# Altium project SOM_MODULE_LN_144201.PrjPcb (part 1 of 4)
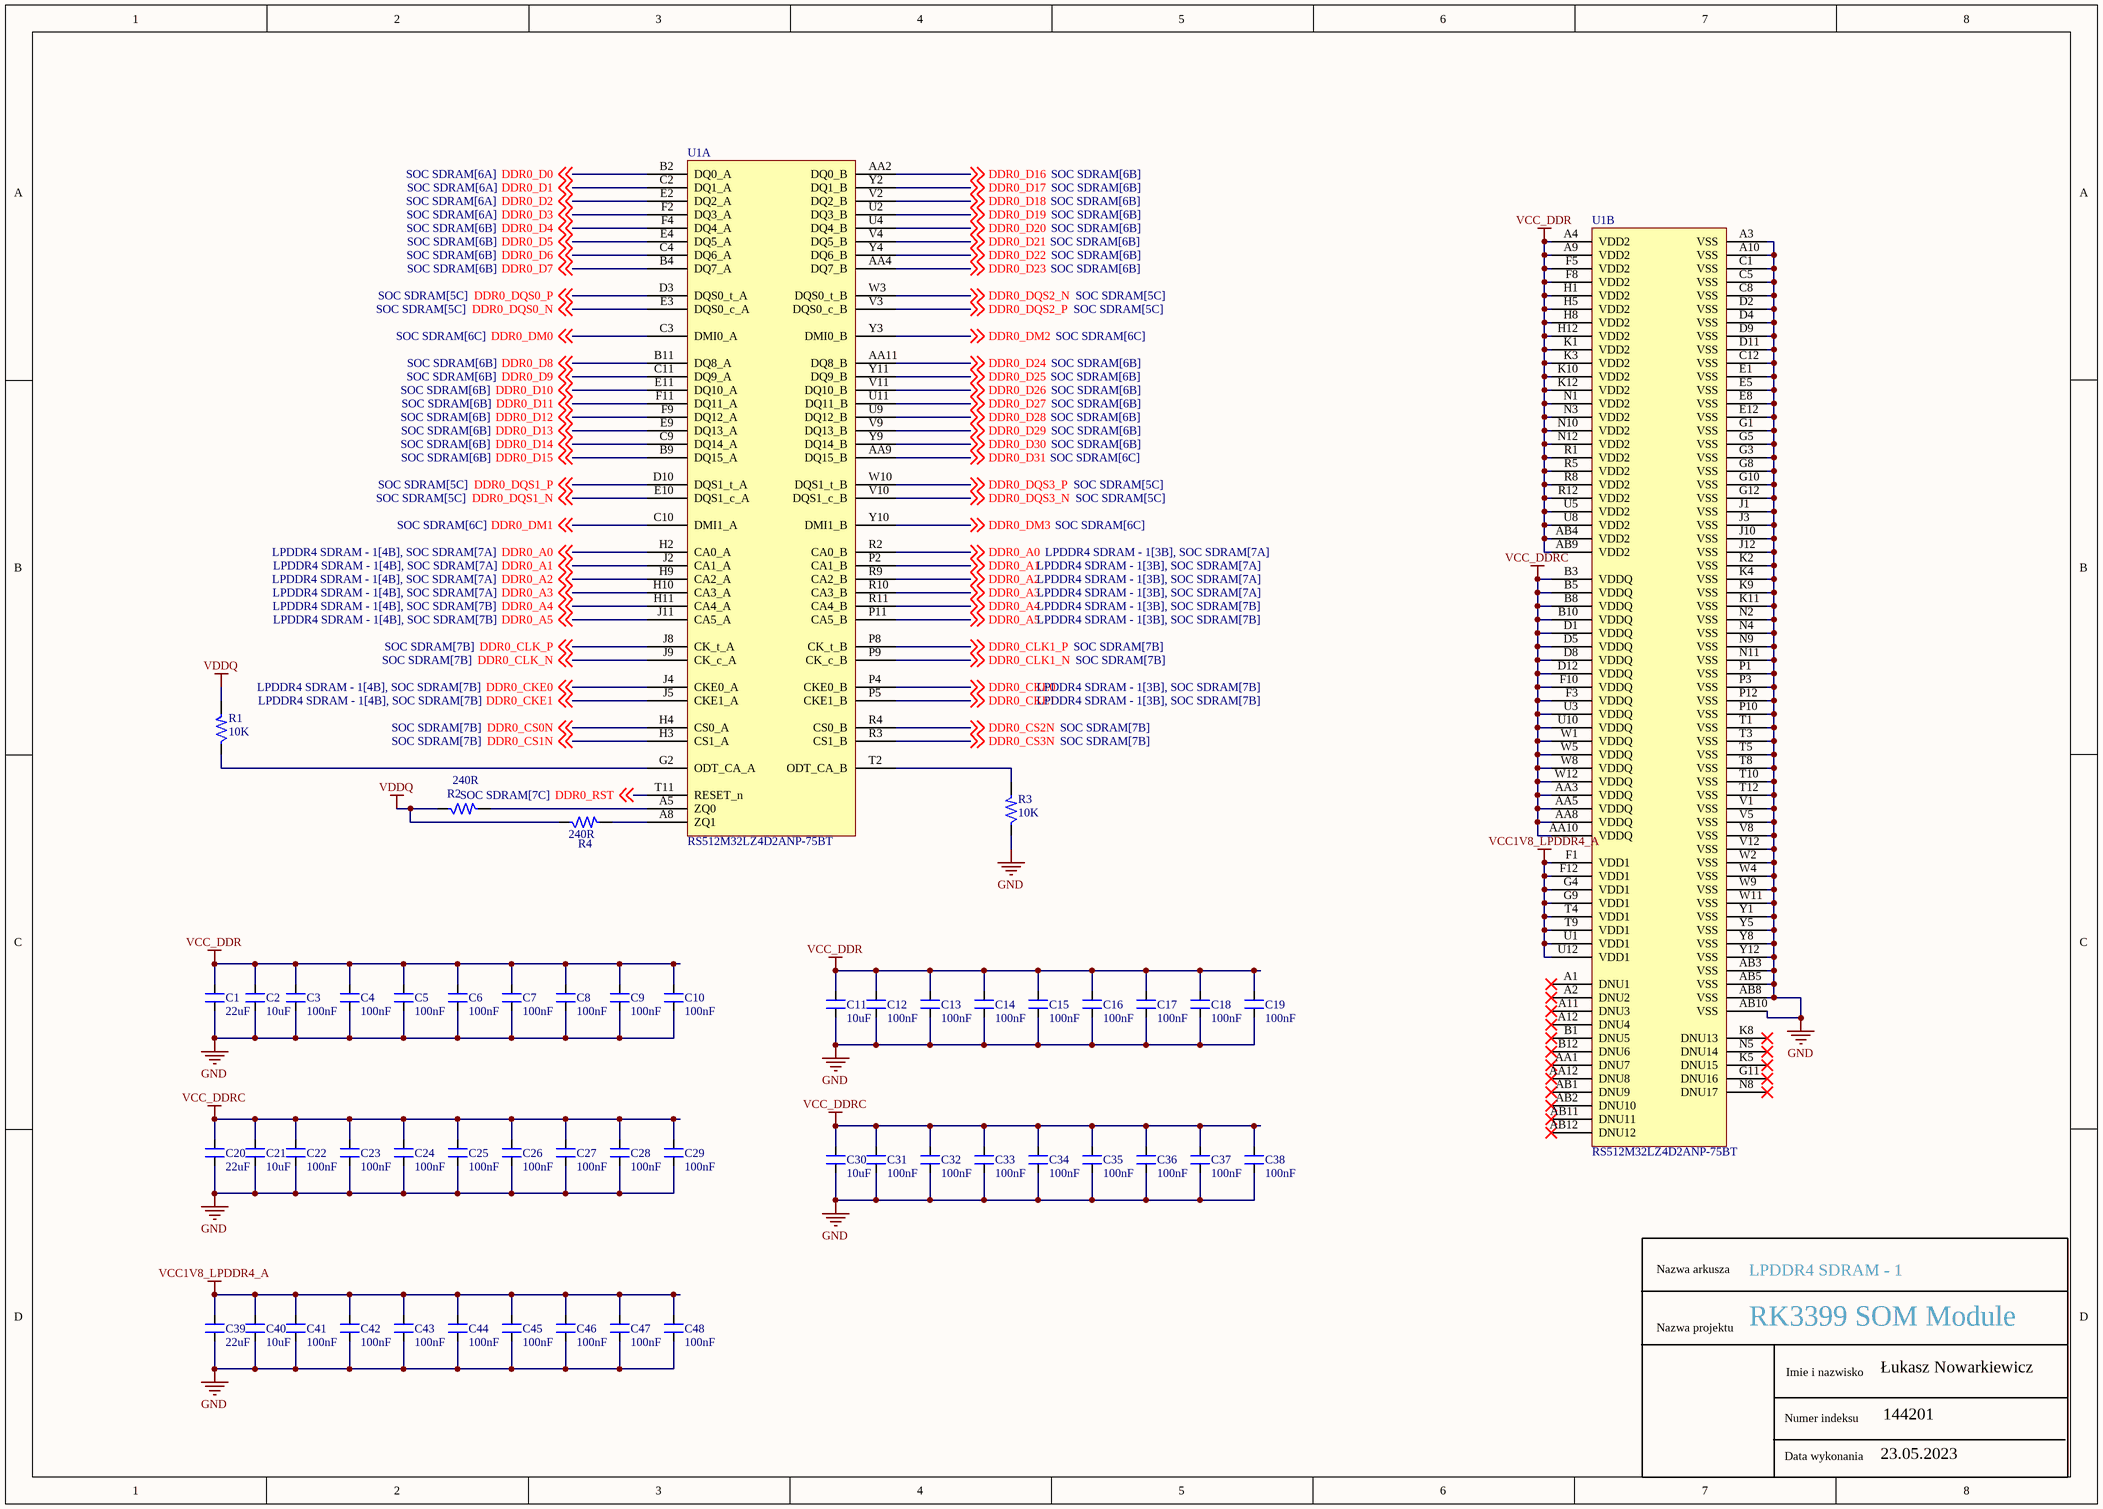
[diagram p0: LPDDR4 SDRAM - 1.SchDoc]
19 sheets, 574 parts. Net scope: global (net labels, ports and power ports of the same name join across sheets).
Board file: SOM.PcbDoc
Sheets:
  LPDDR4 SDRAM - 1.SchDoc
  LPDDR4 SDRAM - 2.SchDoc
  EMMC Flash memory.SchDoc
  WiFi module.SchDoc
  SOC SDRAM.SchDoc
  SOC Power Pins.SchDoc
  SOC EMMC, SDMMC, PCIE, ADC.SchDoc
  SOC Display, HDMI, EDP.SchDoc
  SOC USB, USIC.SchDoc
  SOC MIPI-CSI, I2C.SchDoc
  SOC PMU Controller.SchDoc
  SOC RGMII-SDIO, SPI.SchDoc
  USB C conn & ctrl.SchDoc
  ETH PHY IC.SchDoc
  BTNs and LEDs.SchDoc
  PWR ICs.SchDoc
  PMIC.SchDoc
  DDR4 Conn.SchDoc
  Miscellaneous.SchDoc

## Sheet LPDDR4 SDRAM - 1.SchDoc: RK3399 SOM Module
size A3; Date: 23.05.2023; Author: Łukasz Nowarkiewicz; SheetNumber: 1; SheetTotal: 21; RegistrationBookNumber: 144201; title_sheet: LPDDR4 SDRAM - 1

### Parts
C1  22uF  [CAP_0603]
C2  10uF  [CAP_0603]
C3  100nF  [CAP_0402]
C4  100nF  [CAP_0402]
C5  100nF  [CAP_0402]
C6  100nF  [CAP_0402]
C7  100nF  [CAP_0402]
C8  100nF  [CAP_0402]
C9  100nF  [CAP_0402]
C10  100nF  [CAP_0402]
C11  10uF  [CAP_0603]
C12  100nF  [CAP_0402]
C13  100nF  [CAP_0402]
C14  100nF  [CAP_0402]
C15  100nF  [CAP_0402]
C16  100nF  [CAP_0402]
C17  100nF  [CAP_0402]
C18  100nF  [CAP_0402]
C19  100nF  [CAP_0402]
C20  22uF  [CAP_0603]
C21  10uF  [CAP_0603]
C22  100nF  [CAP_0402]
C23  100nF  [CAP_0402]
C24  100nF  [CAP_0402]
C25  100nF  [CAP_0402]
C26  100nF  [CAP_0402]
C27  100nF  [CAP_0402]
C28  100nF  [CAP_0402]
C29  100nF  [CAP_0402]
C30  10uF  [CAP_0603]
C31  100nF  [CAP_0402]
C32  100nF  [CAP_0402]
C33  100nF  [CAP_0402]
C34  100nF  [CAP_0402]
C35  100nF  [CAP_0402]
C36  100nF  [CAP_0402]
C37  100nF  [CAP_0402]
C38  100nF  [CAP_0402]
C39  22uF  [CAP_0603]
C40  10uF  [CAP_0603]
C41  100nF  [CAP_0402]
C42  100nF  [CAP_0402]
C43  100nF  [CAP_0402]
C44  100nF  [CAP_0402]
C45  100nF  [CAP_0402]
C46  100nF  [CAP_0402]
C47  100nF  [CAP_0402]
C48  100nF  [CAP_0402]
R1  10K  [RES_0201]
R2  240R  [RES_0201]
R3  10K  [RES_0201]
R4  240R  [RES_0201]
U1  RS512M32LZ4D2ANP-75BT  [FBGA200_SMD]  (parts A,B of 2)

### Nets
GND: C1.1 C2.1 C3.1 C4.1 C5.1 C6.1 C7.1 C8.1 C9.1 C10.1 C11.1 C12.1 C13.1 C14.1 C15.1 C16.1 C17.1 C18.1 C19.1 C20.1 C21.1 C22.1 C23.1 C24.1 C25.1 C26.1 C27.1 C28.1 C29.1 C30.1 C31.1 C32.1 C33.1 C34.1 C35.1 C36.1 C37.1 C38.1 C39.1 C40.1 C41.1 C42.1 C43.1 C44.1 C45.1 C46.1 C47.1 C48.1 R3.1 U1.A3(VSS) U1.A10(VSS) U1.AB3(VSS) U1.AB5(VSS) U1.AB8(VSS) U1.AB10(VSS) U1.C1(VSS) U1.C5(VSS) U1.C8(VSS) U1.C12(VSS) U1.D2(VSS) U1.D4(VSS) U1.D9(VSS) U1.D11(VSS) U1.E1(VSS) U1.E5(VSS) U1.E8(VSS) U1.E12(VSS) U1.G1(VSS) U1.G3(VSS) U1.G5(VSS) U1.G8(VSS) U1.G10(VSS) U1.G12(VSS) U1.J1(VSS) U1.J3(VSS) U1.J10(VSS) U1.J12(VSS) U1.K2(VSS) U1.K4(VSS) U1.K9(VSS) U1.K11(VSS) U1.N2(VSS) U1.N4(VSS) U1.N9(VSS) U1.N11(VSS) U1.P1(VSS) U1.P3(VSS) U1.P10(VSS) U1.P12(VSS) U1.T1(VSS) U1.T3(VSS) U1.T5(VSS) U1.T8(VSS) U1.T10(VSS) U1.T12(VSS) U1.V1(VSS) U1.V5(VSS) U1.V8(VSS) U1.V12(VSS) U1.W2(VSS) U1.W4(VSS) U1.W9(VSS) U1.W11(VSS) U1.Y1(VSS) U1.Y5(VSS) U1.Y8(VSS) U1.Y12(VSS)
VCC1V8_LPDDR4_A: C39.2 C40.2 C41.2 C42.2 C43.2 C44.2 C45.2 C46.2 C47.2 C48.2 U1.F1(VDD1) U1.F12(VDD1) U1.G4(VDD1) U1.G9(VDD1) U1.T4(VDD1) U1.T9(VDD1) U1.U1(VDD1) U1.U12(VDD1)
VCC_DDR: C1.2 C2.2 C3.2 C4.2 C5.2 C6.2 C7.2 C8.2 C9.2 C10.2 C11.2 C12.2 C13.2 C14.2 C15.2 C16.2 C17.2 C18.2 C19.2 U1.A4(VDD2) U1.A9(VDD2) U1.AB4(VDD2) U1.AB9(VDD2) U1.F5(VDD2) U1.F8(VDD2) U1.H1(VDD2) U1.H5(VDD2) U1.H8(VDD2) U1.H12(VDD2) U1.K1(VDD2) U1.K3(VDD2) U1.K10(VDD2) U1.K12(VDD2) U1.N1(VDD2) U1.N3(VDD2) U1.N10(VDD2) U1.N12(VDD2) U1.R1(VDD2) U1.R5(VDD2) U1.R8(VDD2) U1.R12(VDD2) U1.U5(VDD2) U1.U8(VDD2)
VCC_DDRC: C20.2 C21.2 C22.2 C23.2 C24.2 C25.2 C26.2 C27.2 C28.2 C29.2 C30.2 C31.2 C32.2 C33.2 C34.2 C35.2 C36.2 C37.2 C38.2 U1.AA3(VDDQ) U1.AA5(VDDQ) U1.AA8(VDDQ) U1.AA10(VDDQ) U1.B3(VDDQ) U1.B5(VDDQ) U1.B8(VDDQ) U1.B10(VDDQ) U1.D1(VDDQ) U1.D5(VDDQ) U1.D8(VDDQ) U1.D12(VDDQ) U1.F3(VDDQ) U1.F10(VDDQ) U1.U3(VDDQ) U1.U10(VDDQ) U1.W1(VDDQ) U1.W5(VDDQ) U1.W8(VDDQ) U1.W12(VDDQ)
VDDQ: R1.2 R2.1 R4.1
DDR0_A0: U1.H2(CA0_A) U1.R2(CA0_B) ; off-sheet DDR0_A0
DDR0_A1: U1.J2(CA1_A) U1.P2(CA1_B) ; off-sheet DDR0_A1
DDR0_A2: U1.H9(CA2_A) U1.R9(CA2_B) ; off-sheet DDR0_A2
DDR0_A3: U1.H10(CA3_A) U1.R10(CA3_B) ; off-sheet DDR0_A3
DDR0_A4: U1.H11(CA4_A) U1.R11(CA4_B) ; off-sheet DDR0_A4
DDR0_A5: U1.J11(CA5_A) U1.P11(CA5_B) ; off-sheet DDR0_A5
DDR0_CKE0: U1.J4(CKE0_A) U1.P4(CKE0_B) ; off-sheet DDR0_CKE0
DDR0_CKE1: U1.J5(CKE1_A) U1.P5(CKE1_B) ; off-sheet DDR0_CKE1
DDR0_CLK1_N: U1.P9(CK_c_B) ; off-sheet DDR0_CLK1_N
DDR0_CLK1_P: U1.P8(CK_t_B) ; off-sheet DDR0_CLK1_P
DDR0_CLK_N: U1.J9(CK_c_A) ; off-sheet DDR0_CLK_N
DDR0_CLK_P: U1.J8(CK_t_A) ; off-sheet DDR0_CLK_P
DDR0_CS0N: U1.H4(CS0_A) ; off-sheet DDR0_CS0N
DDR0_CS1N: U1.H3(CS1_A) ; off-sheet DDR0_CS1N
DDR0_CS2N: U1.R4(CS0_B) ; off-sheet DDR0_CS2N
DDR0_CS3N: U1.R3(CS1_B) ; off-sheet DDR0_CS3N
DDR0_D0: U1.B2(DQ0_A) ; off-sheet DDR0_D0
DDR0_D1: U1.C2(DQ1_A) ; off-sheet DDR0_D1
DDR0_D2: U1.E2(DQ2_A) ; off-sheet DDR0_D2
DDR0_D3: U1.F2(DQ3_A) ; off-sheet DDR0_D3
DDR0_D4: U1.F4(DQ4_A) ; off-sheet DDR0_D4
DDR0_D5: U1.E4(DQ5_A) ; off-sheet DDR0_D5
DDR0_D6: U1.C4(DQ6_A) ; off-sheet DDR0_D6
DDR0_D7: U1.B4(DQ7_A) ; off-sheet DDR0_D7
DDR0_D8: U1.B11(DQ8_A) ; off-sheet DDR0_D8
DDR0_D9: U1.C11(DQ9_A) ; off-sheet DDR0_D9
DDR0_D10: U1.E11(DQ10_A) ; off-sheet DDR0_D10
DDR0_D11: U1.F11(DQ11_A) ; off-sheet DDR0_D11
DDR0_D12: U1.F9(DQ12_A) ; off-sheet DDR0_D12
DDR0_D13: U1.E9(DQ13_A) ; off-sheet DDR0_D13
DDR0_D14: U1.C9(DQ14_A) ; off-sheet DDR0_D14
DDR0_D15: U1.B9(DQ15_A) ; off-sheet DDR0_D15
DDR0_D16: U1.AA2(DQ0_B) ; off-sheet DDR0_D16
DDR0_D17: U1.Y2(DQ1_B) ; off-sheet DDR0_D17
DDR0_D18: U1.V2(DQ2_B) ; off-sheet DDR0_D18
DDR0_D19: U1.U2(DQ3_B) ; off-sheet DDR0_D19
DDR0_D20: U1.U4(DQ4_B) ; off-sheet DDR0_D20
DDR0_D21: U1.V4(DQ5_B) ; off-sheet DDR0_D21
DDR0_D22: U1.Y4(DQ6_B) ; off-sheet DDR0_D22
DDR0_D23: U1.AA4(DQ7_B) ; off-sheet DDR0_D23
DDR0_D24: U1.AA11(DQ8_B) ; off-sheet DDR0_D24
DDR0_D25: U1.Y11(DQ9_B) ; off-sheet DDR0_D25
DDR0_D26: U1.V11(DQ10_B) ; off-sheet DDR0_D26
DDR0_D27: U1.U11(DQ11_B) ; off-sheet DDR0_D27
DDR0_D28: U1.U9(DQ12_B) ; off-sheet DDR0_D28
DDR0_D29: U1.V9(DQ13_B) ; off-sheet DDR0_D29
DDR0_D30: U1.Y9(DQ14_B) ; off-sheet DDR0_D30
DDR0_D31: U1.AA9(DQ15_B) ; off-sheet DDR0_D31
DDR0_DM0: U1.C3(DMI0_A) ; off-sheet DDR0_DM0
DDR0_DM1: U1.C10(DMI1_A) ; off-sheet DDR0_DM1
DDR0_DM2: U1.Y3(DMI0_B) ; off-sheet DDR0_DM2
DDR0_DM3: U1.Y10(DMI1_B) ; off-sheet DDR0_DM3
DDR0_DQS0_N: U1.E3(DQS0_c_A) ; off-sheet DDR0_DQS0_N
DDR0_DQS0_P: U1.D3(DQS0_t_A) ; off-sheet DDR0_DQS0_P
DDR0_DQS1_N: U1.E10(DQS1_c_A) ; off-sheet DDR0_DQS1_N
DDR0_DQS1_P: U1.D10(DQS1_t_A) ; off-sheet DDR0_DQS1_P
DDR0_DQS2_N: U1.W3(DQS0_t_B) ; off-sheet DDR0_DQS2_N
DDR0_DQS2_P: U1.V3(DQS0_c_B) ; off-sheet DDR0_DQS2_P
DDR0_DQS3_N: U1.V10(DQS1_c_B) ; off-sheet DDR0_DQS3_N
DDR0_DQS3_P: U1.W10(DQS1_t_B) ; off-sheet DDR0_DQS3_P
DDR0_RST: U1.T11(RESET_n) ; off-sheet DDR0_RST
NetR1_1: R1.1 U1.G2(ODT_CA_A)
NetR2_2: R2.2 U1.A5(ZQ0)
NetR3_2: R3.2 U1.T2(ODT_CA_B)
NetR4_2: R4.2 U1.A8(ZQ1)

Not connected (* = marked no-connect by the designer): U1 A1(DNU1)* A2(DNU2)* A11(DNU3)* A12(DNU4)* AA1(DNU7)* AA12(DNU8)* AB1(DNU9)* AB2(DNU10)* AB11(DNU11)* AB12(DNU12)* B1(DNU5)* B12(DNU6)* G11(DNU16)* K5(DNU15)* K8(DNU13)* N5(DNU14)* N8(DNU17)*

### Notes on the sheet
- Nazwa arkusza
- Nazwa projektu
- Imie i nazwisko
- Data wykonania
- Numer indeksu

### Library data of the parts
C1 C20 C39 = CAP_22uF-10V-20%-0603: 22µF ±20% 10V Ceramic Capacitor X5R 0603 (1608 Metric); Manufacturer: Murata Electronics; Manufacturer Part Number: GRM188R61A226ME15D; Case/Package: 0603; Supplier-1: Digikey
C2 C11 C21 C30 C40 = CAP_10uF-10V-10%-0603: 10µF ±10% 10V Ceramic Capacitor X5R 0603 (1608 Metric); Manufacturer Part Number: GRM188R61A106KE69J; Manufacturer: Murata Electronics; Case/Package: 0603; Supplier-1: Digikey
C3-C10 C12-C19 C22-C29 C31-C38 C41-C48 = CAP_100nF-10V-10%-0402: 0.1µF ±10% 10V Ceramic Capacitor X7R 0402 (1005 Metric); Manufacturer: Yageo; Manufacturer Part Number: CC0402KRX7R6BB104; Case/Package: 0402; Supplier-1: Digikey
R1 R3 = RES_10K-0.05W-1%-0201: 10 kOhms ±1% 0.05W, 1/20W Chip Resistor 0201 (0603 Metric) Thick Film; Manufacturer: Stackpole Electronics Inc; Manufacturer Part Number: RMCF0201FT10K0; Case/Package: 0201; Supplier-1: Digikey
R2 R4 = RES_240R-0.05W-1%-0201: 240 Ohms ±1% 0.05W, 1/20W Chip Resistor 0201 (0603 Metric) Thick Film; Manufacturer: Yageo; Manufacturer Part Number: RC0201FR-07240RL; Case/Package: 0201; Supplier-1: Digikey
U1 = IC_RS512M32LZ4D2ANP-75BT: LPDDR4/4X Package FBGA 200b Density 4Gbit~64Gbit Operating Temperature Range：-25~85℃ Speed：2667Mbps/3200Mbps/3733Mbps Voltage：VDD1/VDD2/VDDQ= 1.8 / 1.1 / 1.1 V（LPDDR4）VDD1/VDD2/VDDQ = 1.8 / 1.1 / 0.6 V（LPDDR4X）Approved Verification Platform：MTK、Spreadtrum; Manufacturer: RAYSON; Manufacturer Part Number: RS512M32LZ4D2ANP-75BT; Case/Package: FBGA 200b; Supplier-1: RAYSON

## Sheet LPDDR4 SDRAM - 2.SchDoc: RK3399 SOM Module
size A3; Date: 23.05.2023; Author: Łukasz Nowarkiewicz; SheetNumber: 2; SheetTotal: 21; RegistrationBookNumber: 144201; title_sheet: LPDDR4 SDRAM - 2
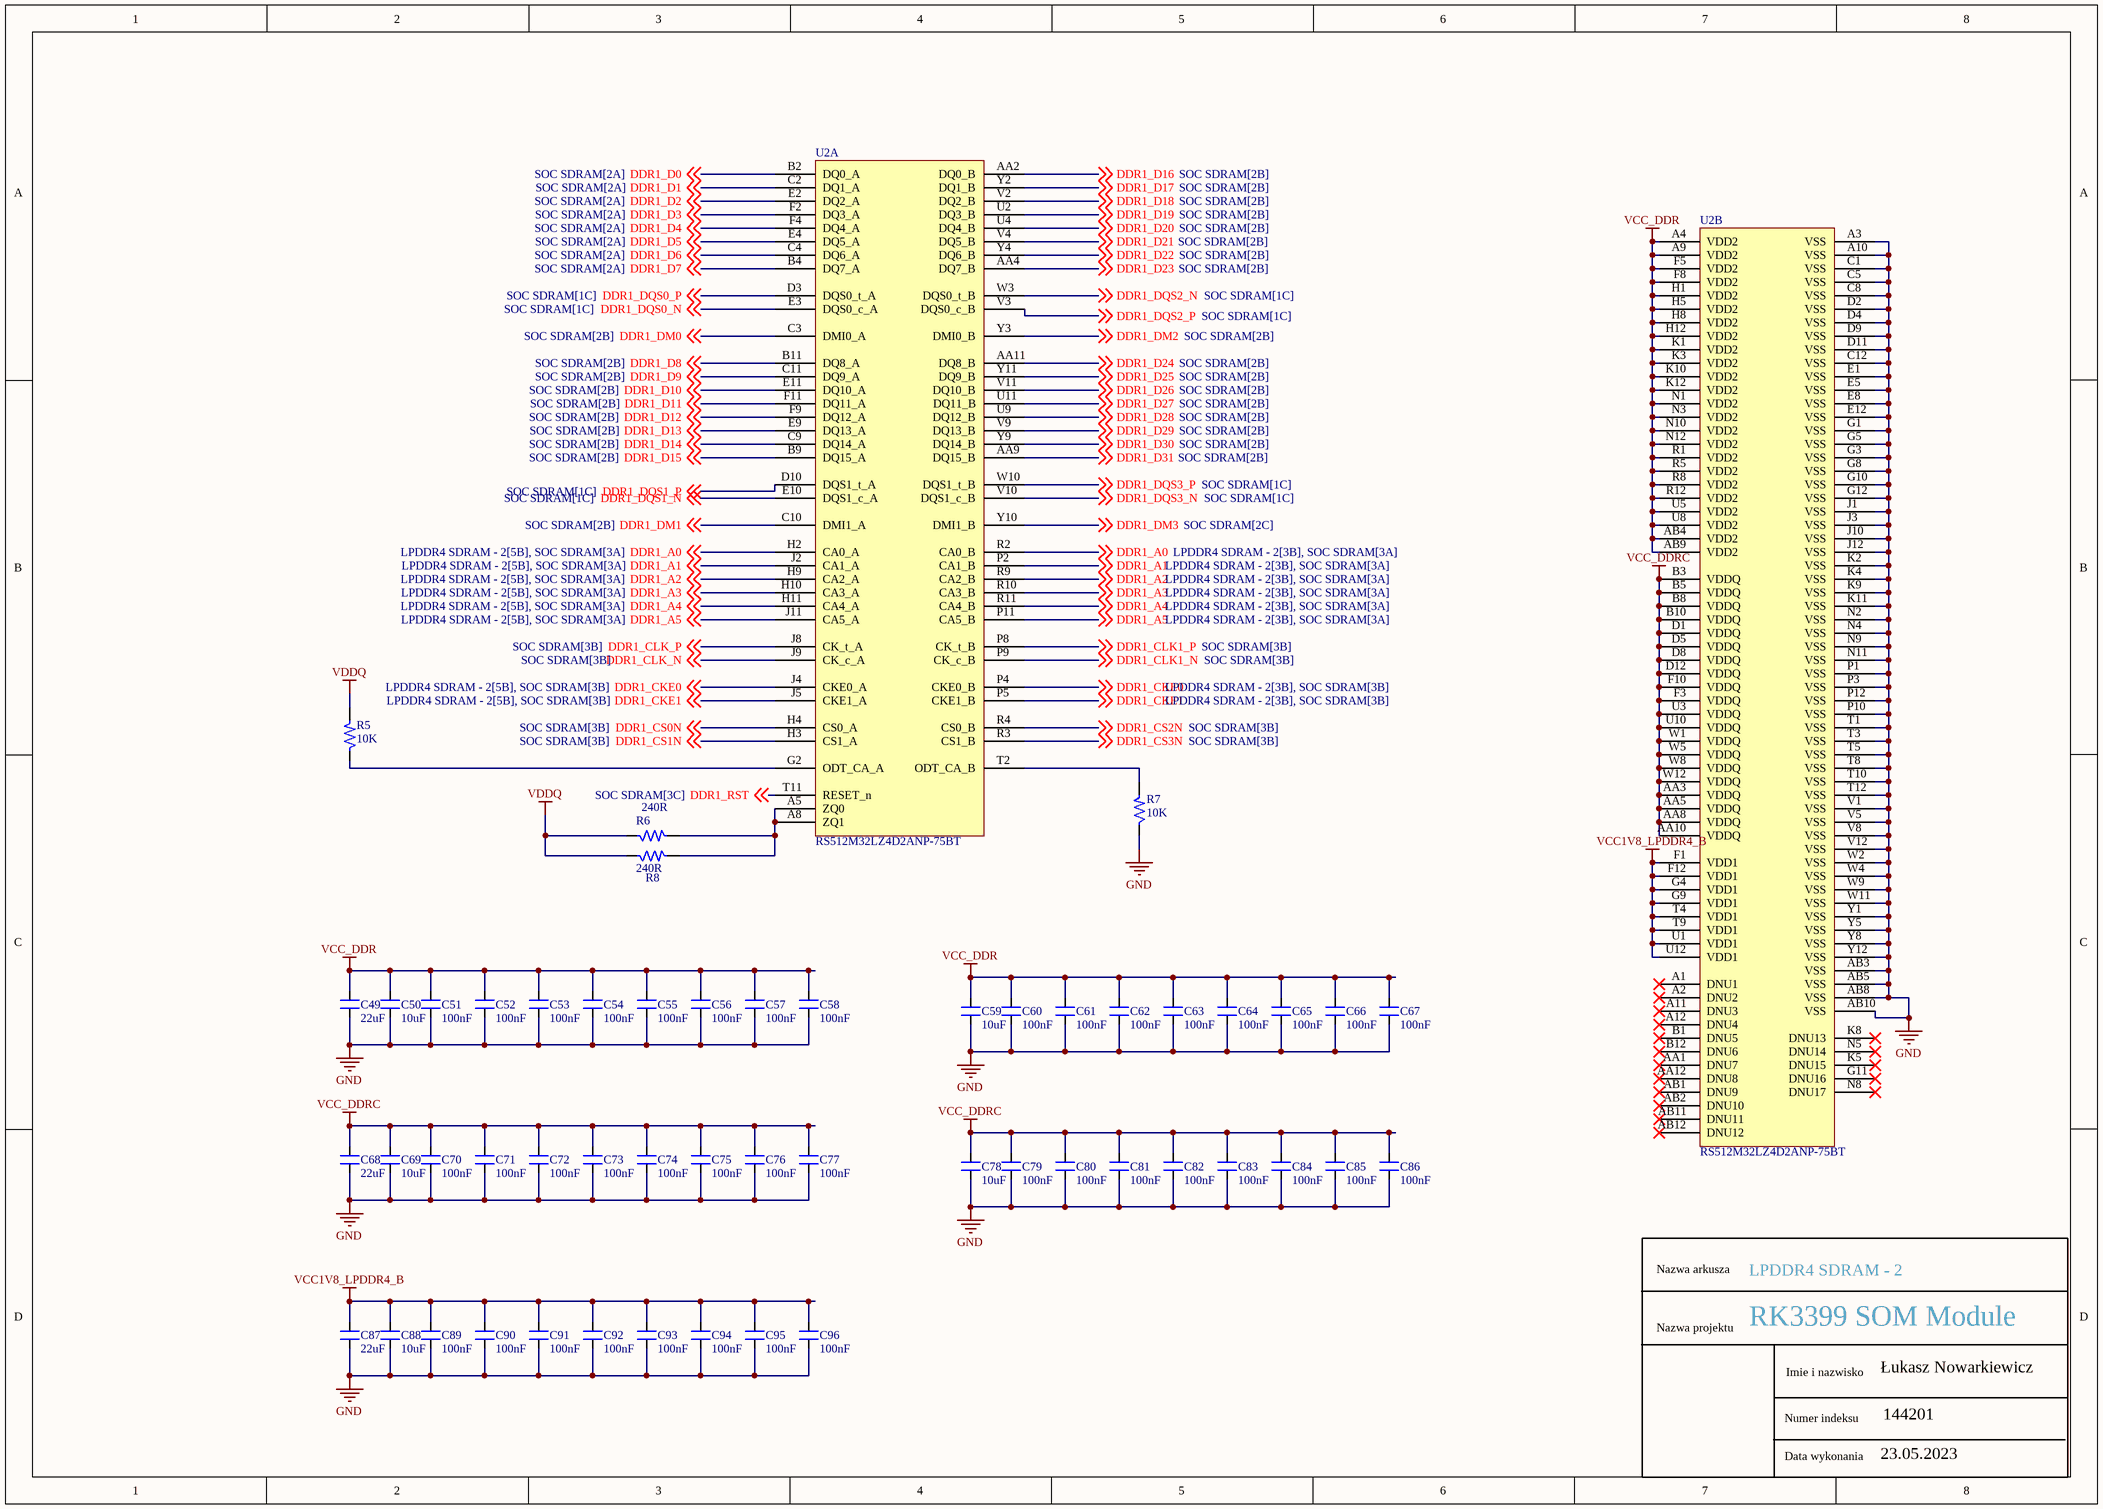
[diagram p1: LPDDR4 SDRAM - 2.SchDoc]

### Parts
C49  22uF  [CAP_0603]
C50  10uF  [CAP_0603]
C51  100nF  [CAP_0402]
C52  100nF  [CAP_0402]
C53  100nF  [CAP_0402]
C54  100nF  [CAP_0402]
C55  100nF  [CAP_0402]
C56  100nF  [CAP_0402]
C57  100nF  [CAP_0402]
C58  100nF  [CAP_0402]
C59  10uF  [CAP_0603]
C60  100nF  [CAP_0402]
C61  100nF  [CAP_0402]
C62  100nF  [CAP_0402]
C63  100nF  [CAP_0402]
C64  100nF  [CAP_0402]
C65  100nF  [CAP_0402]
C66  100nF  [CAP_0402]
C67  100nF  [CAP_0402]
C68  22uF  [CAP_0603]
C69  10uF  [CAP_0603]
C70  100nF  [CAP_0402]
C71  100nF  [CAP_0402]
C72  100nF  [CAP_0402]
C73  100nF  [CAP_0402]
C74  100nF  [CAP_0402]
C75  100nF  [CAP_0402]
C76  100nF  [CAP_0402]
C77  100nF  [CAP_0402]
C78  10uF  [CAP_0603]
C79  100nF  [CAP_0402]
C80  100nF  [CAP_0402]
C81  100nF  [CAP_0402]
C82  100nF  [CAP_0402]
C83  100nF  [CAP_0402]
C84  100nF  [CAP_0402]
C85  100nF  [CAP_0402]
C86  100nF  [CAP_0402]
C87  22uF  [CAP_0603]
C88  10uF  [CAP_0603]
C89  100nF  [CAP_0402]
C90  100nF  [CAP_0402]
C91  100nF  [CAP_0402]
C92  100nF  [CAP_0402]
C93  100nF  [CAP_0402]
C94  100nF  [CAP_0402]
C95  100nF  [CAP_0402]
C96  100nF  [CAP_0402]
R5  10K  [RES_0201]
R6  240R  [RES_0201]
R7  10K  [RES_0201]
R8  240R  [RES_0201]
U2  RS512M32LZ4D2ANP-75BT  [FBGA200_SMD]  (parts A,B of 2)

### Nets
GND: C49.1 C50.1 C51.1 C52.1 C53.1 C54.1 C55.1 C56.1 C57.1 C58.1 C59.1 C60.1 C61.1 C62.1 C63.1 C64.1 C65.1 C66.1 C67.1 C68.1 C69.1 C70.1 C71.1 C72.1 C73.1 C74.1 C75.1 C76.1 C77.1 C78.1 C79.1 C80.1 C81.1 C82.1 C83.1 C84.1 C85.1 C86.1 C87.1 C88.1 C89.1 C90.1 C91.1 C92.1 C93.1 C94.1 C95.1 C96.1 R7.1 U2.A3(VSS) U2.A10(VSS) U2.AB3(VSS) U2.AB5(VSS) U2.AB8(VSS) U2.AB10(VSS) U2.C1(VSS) U2.C5(VSS) U2.C8(VSS) U2.C12(VSS) U2.D2(VSS) U2.D4(VSS) U2.D9(VSS) U2.D11(VSS) U2.E1(VSS) U2.E5(VSS) U2.E8(VSS) U2.E12(VSS) U2.G1(VSS) U2.G3(VSS) U2.G5(VSS) U2.G8(VSS) U2.G10(VSS) U2.G12(VSS) U2.J1(VSS) U2.J3(VSS) U2.J10(VSS) U2.J12(VSS) U2.K2(VSS) U2.K4(VSS) U2.K9(VSS) U2.K11(VSS) U2.N2(VSS) U2.N4(VSS) U2.N9(VSS) U2.N11(VSS) U2.P1(VSS) U2.P3(VSS) U2.P10(VSS) U2.P12(VSS) U2.T1(VSS) U2.T3(VSS) U2.T5(VSS) U2.T8(VSS) U2.T10(VSS) U2.T12(VSS) U2.V1(VSS) U2.V5(VSS) U2.V8(VSS) U2.V12(VSS) U2.W2(VSS) U2.W4(VSS) U2.W9(VSS) U2.W11(VSS) U2.Y1(VSS) U2.Y5(VSS) U2.Y8(VSS) U2.Y12(VSS)
VCC1V8_LPDDR4_B: C87.2 C88.2 C89.2 C90.2 C91.2 C92.2 C93.2 C94.2 C95.2 C96.2 U2.F1(VDD1) U2.F12(VDD1) U2.G4(VDD1) U2.G9(VDD1) U2.T4(VDD1) U2.T9(VDD1) U2.U1(VDD1) U2.U12(VDD1)
VCC_DDR: C49.2 C50.2 C51.2 C52.2 C53.2 C54.2 C55.2 C56.2 C57.2 C58.2 C59.2 C60.2 C61.2 C62.2 C63.2 C64.2 C65.2 C66.2 C67.2 U2.A4(VDD2) U2.A9(VDD2) U2.AB4(VDD2) U2.AB9(VDD2) U2.F5(VDD2) U2.F8(VDD2) U2.H1(VDD2) U2.H5(VDD2) U2.H8(VDD2) U2.H12(VDD2) U2.K1(VDD2) U2.K3(VDD2) U2.K10(VDD2) U2.K12(VDD2) U2.N1(VDD2) U2.N3(VDD2) U2.N10(VDD2) U2.N12(VDD2) U2.R1(VDD2) U2.R5(VDD2) U2.R8(VDD2) U2.R12(VDD2) U2.U5(VDD2) U2.U8(VDD2)
VCC_DDRC: C68.2 C69.2 C70.2 C71.2 C72.2 C73.2 C74.2 C75.2 C76.2 C77.2 C78.2 C79.2 C80.2 C81.2 C82.2 C83.2 C84.2 C85.2 C86.2 U2.AA3(VDDQ) U2.AA5(VDDQ) U2.AA8(VDDQ) U2.AA10(VDDQ) U2.B3(VDDQ) U2.B5(VDDQ) U2.B8(VDDQ) U2.B10(VDDQ) U2.D1(VDDQ) U2.D5(VDDQ) U2.D8(VDDQ) U2.D12(VDDQ) U2.F3(VDDQ) U2.F10(VDDQ) U2.U3(VDDQ) U2.U10(VDDQ) U2.W1(VDDQ) U2.W5(VDDQ) U2.W8(VDDQ) U2.W12(VDDQ)
VDDQ: R5.2 R6.1 R8.1
DDR1_A0: U2.H2(CA0_A) U2.R2(CA0_B) ; off-sheet DDR1_A0
DDR1_A1: U2.J2(CA1_A) U2.P2(CA1_B) ; off-sheet DDR1_A1
DDR1_A2: U2.H9(CA2_A) U2.R9(CA2_B) ; off-sheet DDR1_A2
DDR1_A3: U2.H10(CA3_A) U2.R10(CA3_B) ; off-sheet DDR1_A3
DDR1_A4: U2.H11(CA4_A) U2.R11(CA4_B) ; off-sheet DDR1_A4
DDR1_A5: U2.J11(CA5_A) U2.P11(CA5_B) ; off-sheet DDR1_A5
DDR1_CKE0: U2.J4(CKE0_A) U2.P4(CKE0_B) ; off-sheet DDR1_CKE0
DDR1_CKE1: U2.J5(CKE1_A) U2.P5(CKE1_B) ; off-sheet DDR1_CKE1
DDR1_CLK1_N: U2.P9(CK_c_B) ; off-sheet DDR1_CLK1_N
DDR1_CLK1_P: U2.P8(CK_t_B) ; off-sheet DDR1_CLK1_P
DDR1_CLK_N: U2.J9(CK_c_A) ; off-sheet DDR1_CLK_N
DDR1_CLK_P: U2.J8(CK_t_A) ; off-sheet DDR1_CLK_P
DDR1_CS0N: U2.H4(CS0_A) ; off-sheet DDR1_CS0N
DDR1_CS1N: U2.H3(CS1_A) ; off-sheet DDR1_CS1N
DDR1_CS2N: U2.R4(CS0_B) ; off-sheet DDR1_CS2N
DDR1_CS3N: U2.R3(CS1_B) ; off-sheet DDR1_CS3N
DDR1_D0: U2.B2(DQ0_A) ; off-sheet DDR1_D0
DDR1_D1: U2.C2(DQ1_A) ; off-sheet DDR1_D1
DDR1_D2: U2.E2(DQ2_A) ; off-sheet DDR1_D2
DDR1_D3: U2.F2(DQ3_A) ; off-sheet DDR1_D3
DDR1_D4: U2.F4(DQ4_A) ; off-sheet DDR1_D4
DDR1_D5: U2.E4(DQ5_A) ; off-sheet DDR1_D5
DDR1_D6: U2.C4(DQ6_A) ; off-sheet DDR1_D6
DDR1_D7: U2.B4(DQ7_A) ; off-sheet DDR1_D7
DDR1_D8: U2.B11(DQ8_A) ; off-sheet DDR1_D8
DDR1_D9: U2.C11(DQ9_A) ; off-sheet DDR1_D9
DDR1_D10: U2.E11(DQ10_A) ; off-sheet DDR1_D10
DDR1_D11: U2.F11(DQ11_A) ; off-sheet DDR1_D11
DDR1_D12: U2.F9(DQ12_A) ; off-sheet DDR1_D12
DDR1_D13: U2.E9(DQ13_A) ; off-sheet DDR1_D13
DDR1_D14: U2.C9(DQ14_A) ; off-sheet DDR1_D14
DDR1_D15: U2.B9(DQ15_A) ; off-sheet DDR1_D15
DDR1_D16: U2.AA2(DQ0_B) ; off-sheet DDR1_D16
DDR1_D17: U2.Y2(DQ1_B) ; off-sheet DDR1_D17
DDR1_D18: U2.V2(DQ2_B) ; off-sheet DDR1_D18
DDR1_D19: U2.U2(DQ3_B) ; off-sheet DDR1_D19
DDR1_D20: U2.U4(DQ4_B) ; off-sheet DDR1_D20
DDR1_D21: U2.V4(DQ5_B) ; off-sheet DDR1_D21
DDR1_D22: U2.Y4(DQ6_B) ; off-sheet DDR1_D22
DDR1_D23: U2.AA4(DQ7_B) ; off-sheet DDR1_D23
DDR1_D24: U2.AA11(DQ8_B) ; off-sheet DDR1_D24
DDR1_D25: U2.Y11(DQ9_B) ; off-sheet DDR1_D25
DDR1_D26: U2.V11(DQ10_B) ; off-sheet DDR1_D26
DDR1_D27: U2.U11(DQ11_B) ; off-sheet DDR1_D27
DDR1_D28: U2.U9(DQ12_B) ; off-sheet DDR1_D28
DDR1_D29: U2.V9(DQ13_B) ; off-sheet DDR1_D29
DDR1_D30: U2.Y9(DQ14_B) ; off-sheet DDR1_D30
DDR1_D31: U2.AA9(DQ15_B) ; off-sheet DDR1_D31
DDR1_DM0: U2.C3(DMI0_A) ; off-sheet DDR1_DM0
DDR1_DM1: U2.C10(DMI1_A) ; off-sheet DDR1_DM1
DDR1_DM2: U2.Y3(DMI0_B) ; off-sheet DDR1_DM2
DDR1_DM3: U2.Y10(DMI1_B) ; off-sheet DDR1_DM3
DDR1_DQS0_N: U2.E3(DQS0_c_A) ; off-sheet DDR1_DQS0_N
DDR1_DQS0_P: U2.D3(DQS0_t_A) ; off-sheet DDR1_DQS0_P
DDR1_DQS1_N: U2.E10(DQS1_c_A) ; off-sheet DDR1_DQS1_N
DDR1_DQS1_P: U2.D10(DQS1_t_A) ; off-sheet DDR1_DQS1_P
DDR1_DQS2_N: U2.W3(DQS0_t_B) ; off-sheet DDR1_DQS2_N
DDR1_DQS2_P: U2.V3(DQS0_c_B) ; off-sheet DDR1_DQS2_P
DDR1_DQS3_N: U2.V10(DQS1_c_B) ; off-sheet DDR1_DQS3_N
DDR1_DQS3_P: U2.W10(DQS1_t_B) ; off-sheet DDR1_DQS3_P
DDR1_RST: U2.T11(RESET_n) ; off-sheet DDR1_RST
NetR5_1: R5.1 U2.G2(ODT_CA_A)
NetR6_2: R6.2 R8.2 U2.A5(ZQ0) U2.A8(ZQ1)
NetR7_2: R7.2 U2.T2(ODT_CA_B)

Not connected (* = marked no-connect by the designer): U2 A1(DNU1)* A2(DNU2)* A11(DNU3)* A12(DNU4)* AA1(DNU7)* AA12(DNU8)* AB1(DNU9)* AB2(DNU10)* AB11(DNU11)* AB12(DNU12)* B1(DNU5)* B12(DNU6)* G11(DNU16)* K5(DNU15)* K8(DNU13)* N5(DNU14)* N8(DNU17)*

### Notes on the sheet
- Nazwa arkusza
- Nazwa projektu
- Imie i nazwisko
- Data wykonania
- Numer indeksu

### Library data of the parts
C49 C68 C87 = CAP_22uF-10V-20%-0603: as C1 on sheet LPDDR4 SDRAM - 1; Case/Package: 0603; Supplier-1: Digikey
C50 C59 C69 C78 C88 = CAP_10uF-10V-10%-0603: as C2 on sheet LPDDR4 SDRAM - 1; Case/Package: 0603; Supplier-1: Digikey
C51-C58 C60-C67 C70-C77 C79-C86 C89-C96 = CAP_100nF-10V-10%-0402: as C3 on sheet LPDDR4 SDRAM - 1; Case/Package: 0402; Supplier-1: Digikey
R5 R7 = RES_10K-0.05W-1%-0201: as R1 on sheet LPDDR4 SDRAM - 1; Case/Package: 0201; Supplier-1: Digikey
R6 R8 = RES_240R-0.05W-1%-0201: as R2 on sheet LPDDR4 SDRAM - 1; Case/Package: 0201; Supplier-1: Digikey
U2 = IC_RS512M32LZ4D2ANP-75BT: as U1 on sheet LPDDR4 SDRAM - 1; Manufacturer Part Number: RS512M32LZ4D2ANP-75BT; Case/Package: FBGA 200b; Supplier-1: RAYSON

## Sheet EMMC Flash memory.SchDoc: RK3399 SOM Module
size A4; Date: 23.05.2023; Author: Łukasz Nowarkiewicz; SheetNumber: 3; SheetTotal: 21; RegistrationBookNumber: 144201; title_sheet: EMMC Flash Memory
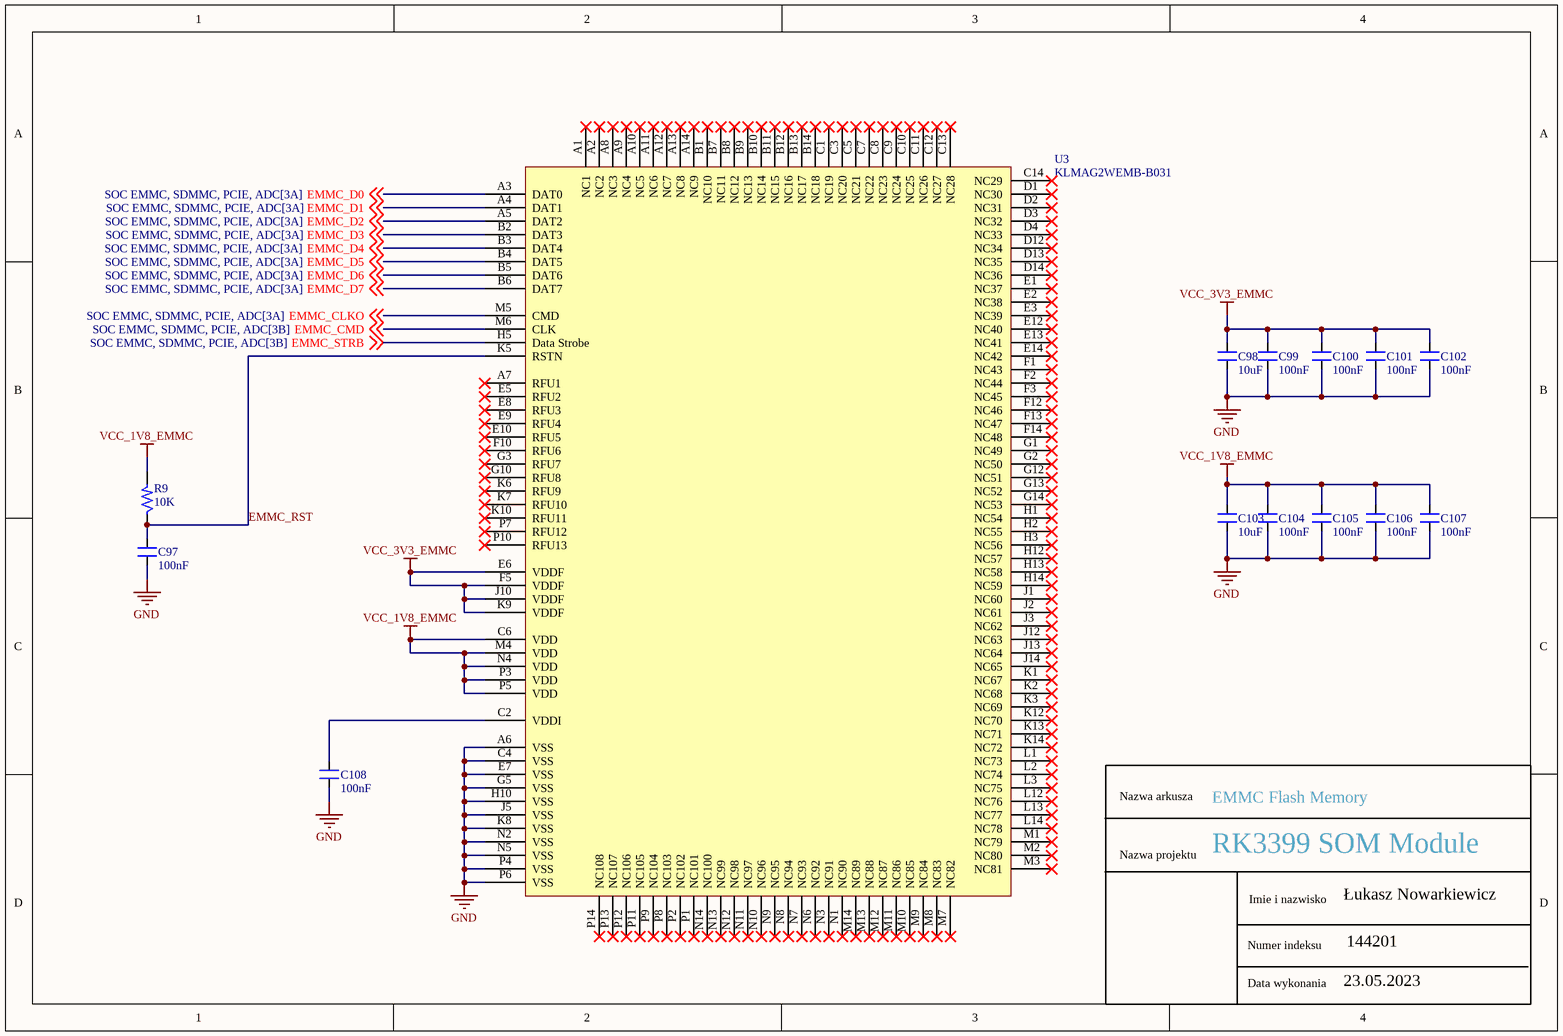
[diagram p2: EMMC Flash memory.SchDoc]

### Parts
C97  100nF  [CAP_0402]
C98  10uF  [CAP_0603]
C99  100nF  [CAP_0402]
C100  100nF  [CAP_0402]
C101  100nF  [CAP_0402]
C102  100nF  [CAP_0402]
C103  10uF  [CAP_0603]
C104  100nF  [CAP_0402]
C105  100nF  [CAP_0402]
C106  100nF  [CAP_0402]
C107  100nF  [CAP_0402]
C108  100nF  [CAP_0402]
R9  10K  [RES_0201]
U3  KLMAG2WEMB-B031  [BGA153C50P14X14_1150X1300X70]

### Nets
GND: C97.1 C98.1 C99.1 C100.1 C101.1 C102.1 C103.1 C104.1 C105.1 C106.1 C107.1 C108.1 U3.A6(VSS) U3.C4(VSS) U3.E7(VSS) U3.G5(VSS) U3.H10(VSS) U3.J5(VSS) U3.K8(VSS) U3.N2(VSS) U3.N5(VSS) U3.P4(VSS) U3.P6(VSS)
VCC_1V8_EMMC: C103.2 C104.2 C105.2 C106.2 C107.2 R9.2 U3.C6(VDD) U3.M4(VDD) U3.N4(VDD) U3.P3(VDD) U3.P5(VDD)
VCC_3V3_EMMC: C98.2 C99.2 C100.2 C101.2 C102.2 U3.E6(VDDF) U3.F5(VDDF) U3.J10(VDDF) U3.K9(VDDF)
EMMC_CLKO: U3.M5(CMD) ; off-sheet EMMC_CLKO
EMMC_CMD: U3.M6(CLK) ; off-sheet EMMC_CMD
EMMC_D0: U3.A3(DAT0) ; off-sheet EMMC_D0
EMMC_D1: U3.A4(DAT1) ; off-sheet EMMC_D1
EMMC_D2: U3.A5(DAT2) ; off-sheet EMMC_D2
EMMC_D3: U3.B2(DAT3) ; off-sheet EMMC_D3
EMMC_D4: U3.B3(DAT4) ; off-sheet EMMC_D4
EMMC_D5: U3.B4(DAT5) ; off-sheet EMMC_D5
EMMC_D6: U3.B5(DAT6) ; off-sheet EMMC_D6
EMMC_D7: U3.B6(DAT7) ; off-sheet EMMC_D7
EMMC_RST: C97.2 R9.1 U3.K5(RSTN)
EMMC_STRB: U3.H5(Data_Strobe) ; off-sheet EMMC_STRB
NetC108_2: C108.2 U3.C2(VDDI)

Not connected (* = marked no-connect by the designer): U3 A1(NC1)* A2(NC2)* A7(RFU1)* A8(NC3)* A9(NC4)* A10(NC5)* A11(NC6)* A12(NC7)* A13(NC8)* A14(NC9)* B1(NC10)* B7(NC11)* B8(NC12)* B9(NC13)* B10(NC14)* B11(NC15)* B12(NC16)* B13(NC17)* B14(NC18)* C1(NC19)* C3(NC20)* C5(NC21)* C7(NC22)* C8(NC23)* C9(NC24)* C10(NC25)* C11(NC26)* C12(NC27)* C13(NC28)* C14(NC29)* D1(NC30)* D2(NC31)* D3(NC32)* D4(NC33)* D12(NC34)* D13(NC35)* D14(NC36)* E1(NC37)* E2(NC38)* E3(NC39)* E5(RFU2)* E8(RFU3)* E9(RFU4)* E10(RFU5)* E12(NC40)* E13(NC41)* E14(NC42)* F1(NC43)* F2(NC44)* F3(NC45)* F10(RFU6)* F12(NC46)* F13(NC47)* F14(NC48)* G1(NC49)* G2(NC50)* G3(RFU7)* G10(RFU8)* G12(NC51)* G13(NC52)* G14(NC53)* H1(NC54)* H2(NC55)* H3(NC56)* H12(NC57)* H13(NC58)* H14(NC59)* J1(NC60)* J2(NC61)* J3(NC62)* J12(NC63)* J13(NC64)* J14(NC65)* K1(NC67)* K2(NC68)* K3(NC69)* K6(RFU9)* K7(RFU10)* K10(RFU11)* K12(NC70)* K13(NC71)* K14(NC72)* L1(NC73)* L2(NC74)* L3(NC75)* L12(NC76)* L13(NC77)* L14(NC78)* M1(NC79)* M2(NC80)* M3(NC81)* M7(NC82)* M8(NC83)* M9(NC84)* M10(NC85)* M11(NC86)* M12(NC87)* M13(NC88)* M14(NC89)* N1(NC90)* N3(NC91)* N6(NC92)* N7(NC93)* N8(NC94)* N9(NC95)* N10(NC96)* N11(NC97)* N12(NC98)* N13(NC99)* N14(NC100)* P1(NC101)* P2(NC102)* P7(RFU12)* P8(NC103)* P9(NC104)* P10(RFU13)* P11(NC105)* P12(NC106)* P13(NC107)* P14(NC108)*

### Notes on the sheet
- Nazwa arkusza
- Nazwa projektu
- Imie i nazwisko
- Data wykonania
- Numer indeksu

### Library data of the parts
C97 C99-C102 C104-C108 = CAP_100nF-10V-10%-0402: as C3 on sheet LPDDR4 SDRAM - 1; Case/Package: 0402; Supplier-1: Digikey
C98 C103 = CAP_10uF-10V-10%-0603: as C2 on sheet LPDDR4 SDRAM - 1; Case/Package: 0603; Supplier-1: Digikey
R9 = RES_10K-0.05W-1%-0201: as R1 on sheet LPDDR4 SDRAM - 1; Case/Package: 0201; Supplier-1: Digikey
U3 = IC_KLMAG2WEMB-B031: 16GB NAND Flash Memory; Manufacturer: Samsung Electronics; Manufacturer Part Number: KLMAG2WEMB-B031; Case/Package: 153-FBGA; Supplier-1: NA

## Sheet WiFi module.SchDoc: RK3399 SOM Module
size A4; Date: 23.05.2023; Author: Łukasz Nowarkiewicz; SheetNumber: 4; SheetTotal: 21; RegistrationBookNumber: 144201; title_sheet: WiFi Module
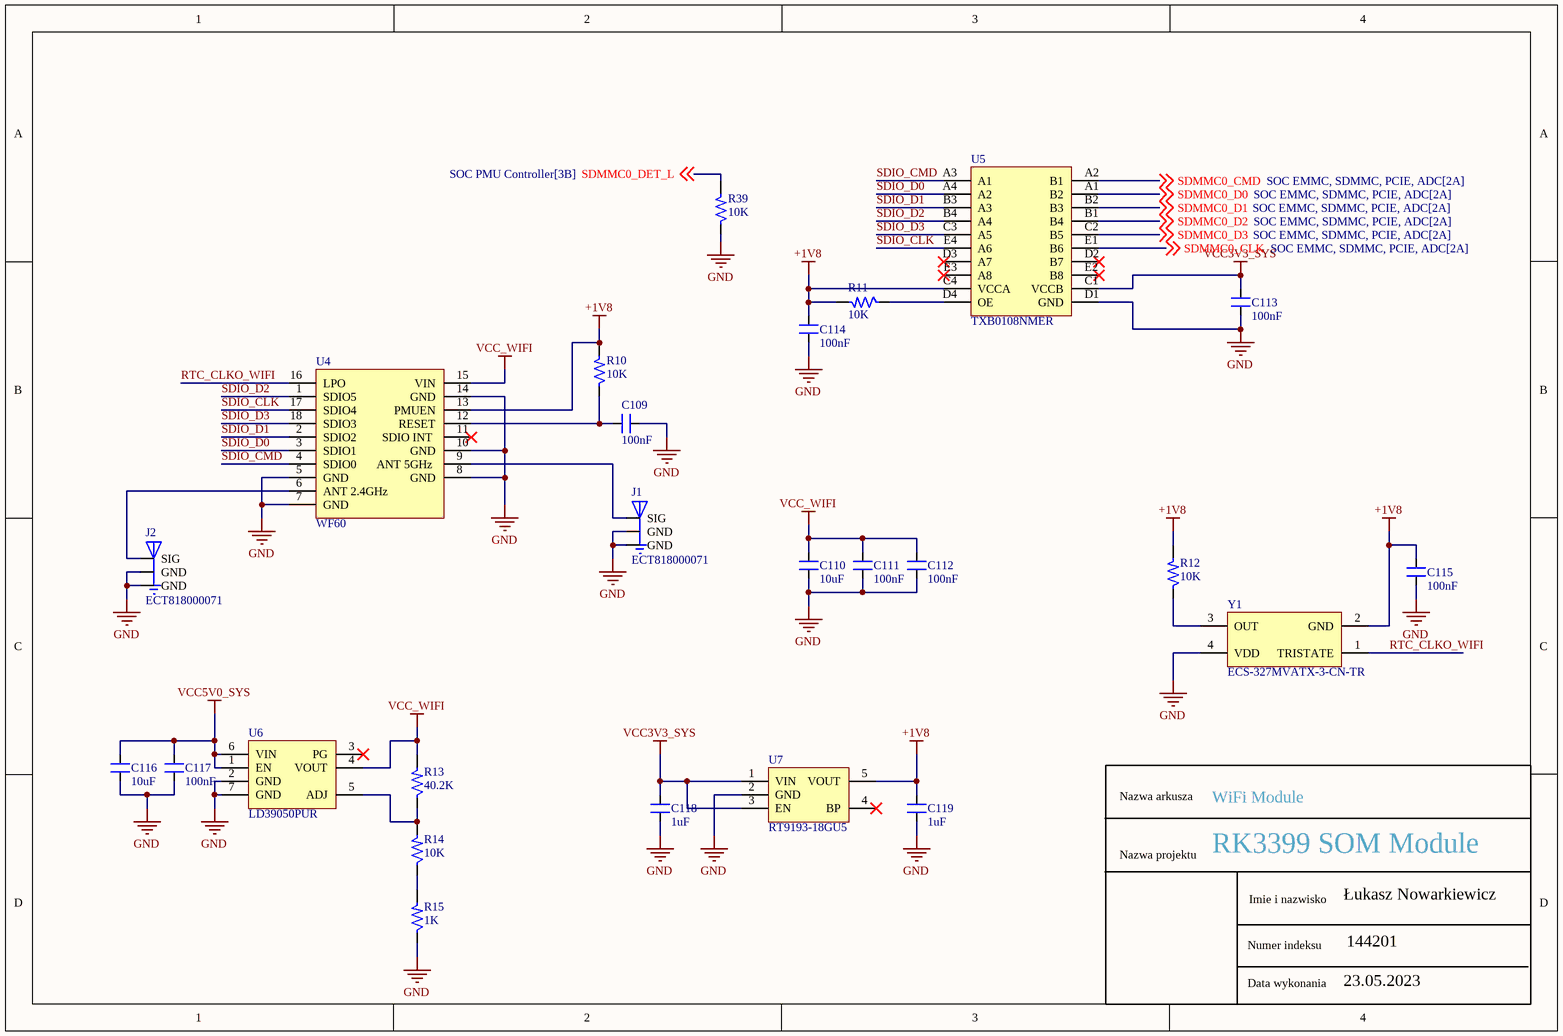
[diagram p3: WiFi module.SchDoc]

### Parts
C109  100nF  [CAP_0402]
C110  10uF  [CAP_0603]
C111  100nF  [CAP_0402]
C112  100nF  [CAP_0402]
C113  100nF  [CAP_0402]
C114  100nF  [CAP_0402]
C115  100nF  [CAP_0402]
C116  10uF  [CAP_0603]
C117  100nF  [CAP_0402]
C118  1uF  [CAP_0402]
C119  1uF  [CAP_0402]
J1  ECT818000071  [CON3_UFL_116_SMD_ST]
J2  ECT818000071  [CON3_UFL_116_SMD_ST]
R10  10K  [RES_0201]
R11  10K  [RES_0201]
R12  10K  [RES_0201]
R13  40.2K  [RES_0201]
R14  10K  [RES_0201]
R15  1K  [RES_0201]
R39  10K  [RES_0402]
U4  WF60  [MOD_WF60]
U5  TXB0108NMER  [NFBGA_31.4_125.9X102.36]
U6  LD39050PUR  [DFN-6_37.4_165_33X15_SMD]
U7  RT9193-18GU5  [SC70-5]
Y1  ECS-327MVATX-3-CN-TR  [XTAL_57_35X31_SMD]

### Nets
+1V8: C114.2 C115.2 C119.2 R10.2 R11.2 R12.2 U4.13(PMUEN) U5.C4(VCCA) U7.5(VOUT) Y1.2(GND)
GND: C109.2 C110.1 C111.1 C112.2 C113.1 C114.1 C115.1 C116.1 C117.1 C118.1 C119.1 J1.1(GND) J1.3(GND) J2.1(GND) J2.3(GND) R15.1 R39.1 U4.5(GND) U4.7(GND) U4.8(GND) U4.10(GND) U4.14(GND) U5.D1(GND) U6.2(GND) U6.7(GND) U7.2(GND) Y1.4(VDD)
VCC3V3_SYS: C113.2 C118.2 U5.C1(VCCB) U7.1(VIN) U7.3(EN)
VCC5V0_SYS: C116.2 C117.2 U6.1(EN) U6.6(VIN)
VCC_WIFI: C110.2 C111.2 C112.1 R13.2 U4.15(VIN) U6.4(VOUT)
RTC_CLKO_WIFI: U4.16(LPO) Y1.1(TRISTATE)
SDIO_CLK: U4.17(SDIO4) U5.E4(A6)
SDIO_CMD: U4.4(SDIO0) U5.A3(A1)
SDIO_D0: U4.3(SDIO1) U5.A4(A2)
SDIO_D1: U4.2(SDIO2) U5.B3(A3)
SDIO_D2: U4.1(SDIO5) U5.B4(A4)
SDIO_D3: U4.18(SDIO3) U5.C3(A5)
SDMMC0_CLK: U5.E1(B6) ; off-sheet SDMMC0_CLK
SDMMC0_CMD: U5.A2(B1) ; off-sheet SDMMC0_CMD
SDMMC0_D0: U5.A1(B2) ; off-sheet SDMMC0_D0
SDMMC0_D1: U5.B2(B3) ; off-sheet SDMMC0_D1
SDMMC0_D2: U5.B1(B4) ; off-sheet SDMMC0_D2
SDMMC0_D3: U5.C2(B5) ; off-sheet SDMMC0_D3
SDMMC0_DET_L: R39.2 ; off-sheet SDMMC0_DET_L
NetC109_1: C109.1 R10.1 U4.12(RESET)
NetJ1_2: J1.2(SIG) U4.9(ANT_5GHz)
NetJ2_2: J2.2(SIG) U4.6(ANT_2.4GHz)
NetR11_1: R11.1 U5.D4(OE)
NetR12_1: R12.1 Y1.3(OUT)
NetR13_1: R13.1 R14.2 U6.5(ADJ)
NetR14_1: R14.1 R15.2

Not connected (* = marked no-connect by the designer): U4 11(SDIO_INT_)*; U5 D2(B7)* D3(A7)* E2(B8)* E3(A8)*; U6 3(PG)*; U7 4(BP)*

### Notes on the sheet
- Nazwa arkusza
- Nazwa projektu
- Imie i nazwisko
- Data wykonania
- Numer indeksu

### Library data of the parts
C109 C111-C115 C117 = CAP_100nF-10V-10%-0402: as C3 on sheet LPDDR4 SDRAM - 1; Case/Package: 0402; Supplier-1: Digikey
C110 C116 = CAP_10uF-10V-10%-0603: as C2 on sheet LPDDR4 SDRAM - 1; Case/Package: 0603; Supplier-1: Digikey
C118 C119 = CAP_1uF-10V-10%-0402: 1µF ±10% 10V Ceramic Capacitor X6S 0402 (1005 Metric); Manufacturer: Murata Electronics; Manufacturer Part Number: GRT155C81A105KE01D; Case/Package: 0402; Supplier-1: Digikey
J1 J2 = CON-PLG_3X1-ECT818000071-ST-SMD: SMD RF Connectors/Coaxial Connectors RoHS; Manufacturer: ECT; Manufacturer Part Number: ECT818000071; Case/Package: SMD; Supplier-1: LCSC
R10-R12 R14 = RES_10K-0.05W-1%-0201: as R1 on sheet LPDDR4 SDRAM - 1; Case/Package: 0201; Supplier-1: Digikey
R13 = RES_40.2K-0.05W-1%-0201: 40.2 kOhms ±1% 0.05W, 1/20W Chip Resistor 0201 (0603 Metric) Automotive AEC-Q200, Moisture Resistant Thick Film; Manufacturer: Yageo; Manufacturer Part Number: AC0201FR-0740K2L; Case/Package: 0201; Supplier-1: Digikey
R15 = RES_1K-0.05W-1%-0201: 1 kOhms ±1% 0.05W, 1/20W Chip Resistor 0201 (0603 Metric) Thick Film; Manufacturer: Yageo; Manufacturer Part Number: RC0201FR-071KL; Case/Package: 0201; Supplier-1: Digikey
R39 = RES_10K-0.1W-1%-0402: 10 kOhms ±1% 0.1W, 1/10W Chip Resistor 0402 (1005 Metric) Anti-Sulfur Thin Film; Manufacturer: Vishay Beyschlag/Draloric/BC Components; Manufacturer Part Number: MCS04020C1002FE000; Case/Package: 0402; Supplier-1: Digikey
U4 = MOD_WF60-SMD: Amp’ed RF Tech presents the WF60 WiFi dual / band module: 802.11abgn.; Alternate Part Number-1: NA; Manufacturer: Amp’ed; Manufacturer Part Number: WF60; Case/Package: SMD; Supplier-1: Arrow; Supplier Part Number-1: WF60; Category: Module; Number of Pins: 16
U5 = IC_TXB0108NMER: Translation - Voltage Levels 8-Bit Bidirectional Voltage-Level Shifter with Auto Direction Sensing and +/-15-kV ESD Protect; Manufacturer: Texas Instruments; Manufacturer Part Number: TXB0108NMER; Case/Package: NFBGA-20; Supplier-1: Mouser
U6 = REG_5.5V-0~5.1V-0.5A-2.55W-DFN-6: Adjustable 5.5V 0.8V 500mA DFN-6 Linear Voltage Regulators RoHS; Manufacturer: STMicroelectronics; Alternate Part Number-1: NA; Manufacturer Part Number: LD39050PUR; Case/Package: DFN-6; Supplier-1: LCSC; Supplier Part Number-1: C222094; Category: Regulators; Number of Pins: 6
U7 = REG_1.8V-300mA-5.5V-SC70-5: Linear Voltage Regulator IC 1 Output 300mA SC-70-5; Manufacturer: Richtek USA Inc.; Manufacturer Part Number: RT9193-18GU5; Case/Package: SC70-5; Supplier-1: Digikey
Y1 = XTAL_ECS-327MVATX-2-CN-TR: 32.768kHz XO (Standard) CMOS Oscillator 1.6V ~ 3.6V Enable/Disable 4-SMD, No Lead; Manufacturer: ECS INC; Alternate Part Number-1: NA; Manufacturer Part Number: ECS-327MVATX-3-CN-TR; Case/Package: SMD-4; Supplier-1: Digikey; Supplier Part Number-1: ECS-327MVATX-3-CN-TR; Category: Crystal; Number of Pins: 4

## Sheet SOC SDRAM.SchDoc: RK3399 SOM Module
size A3; Date: 23.05.2023; Author: Łukasz Nowarkiewicz; SheetNumber: 5; SheetTotal: 21; RegistrationBookNumber: 144201; title_sheet: SOC SDRAM
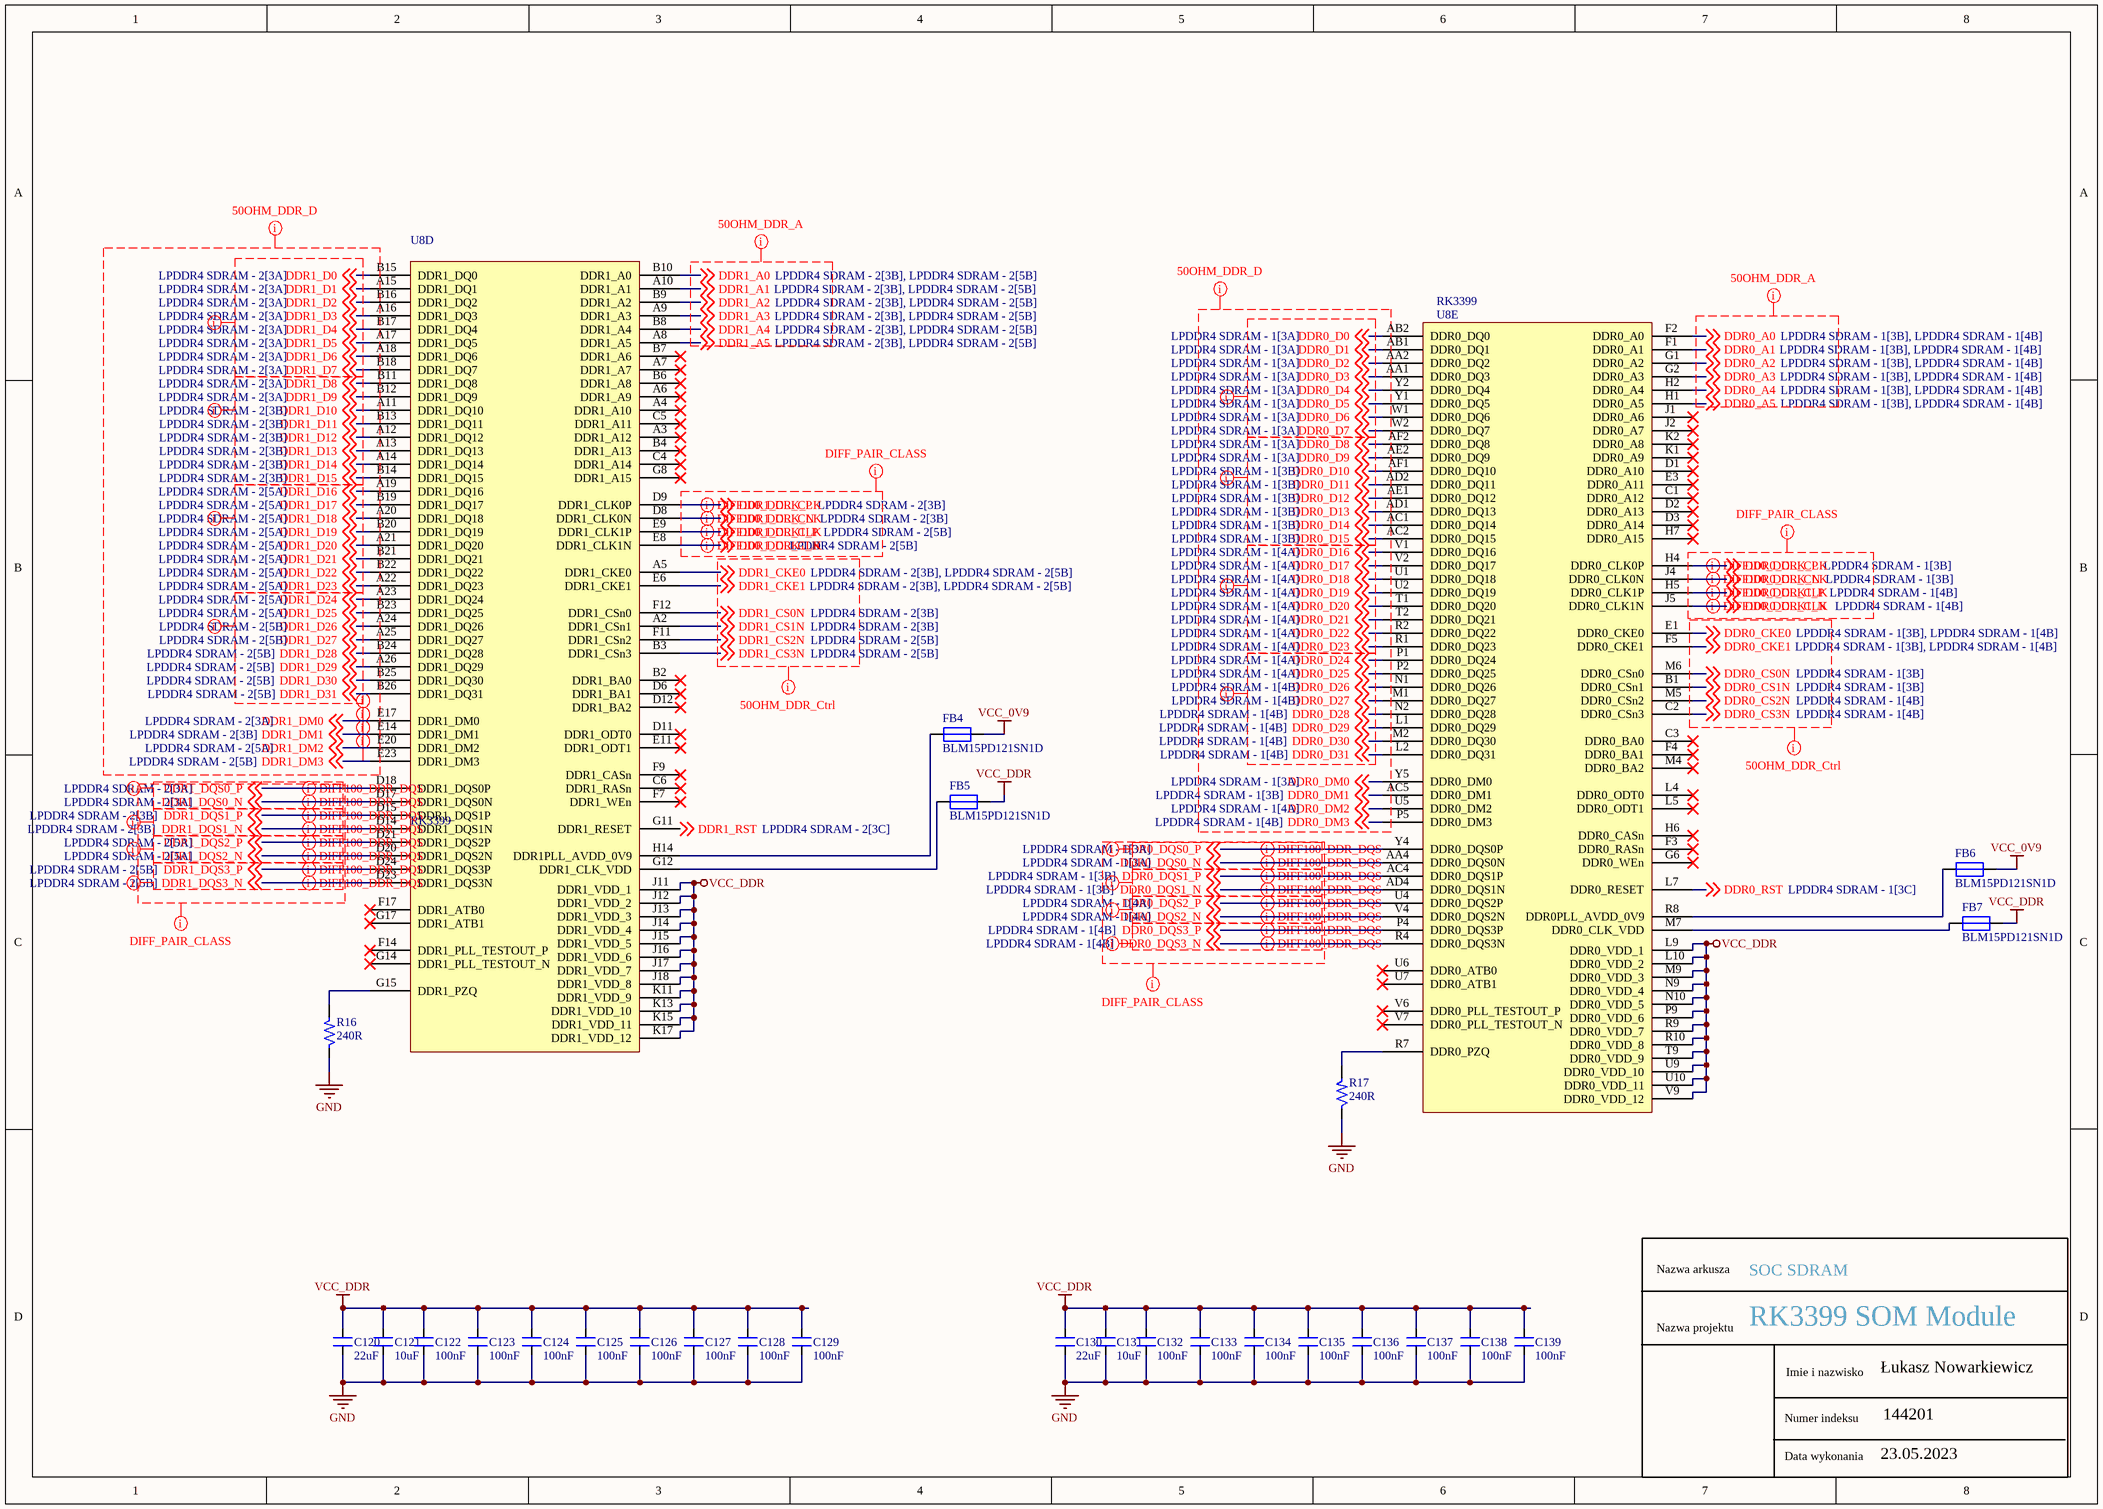
[diagram p4: SOC SDRAM.SchDoc]

### Parts
C120  22uF  [CAP_0603]
C121  10uF  [CAP_0603]
C122  100nF  [CAP_0402]
C123  100nF  [CAP_0402]
C124  100nF  [CAP_0402]
C125  100nF  [CAP_0402]
C126  100nF  [CAP_0402]
C127  100nF  [CAP_0402]
C128  100nF  [CAP_0402]
C129  100nF  [CAP_0402]
C130  22uF  [CAP_0603]
C131  10uF  [CAP_0603]
C132  100nF  [CAP_0402]
C133  100nF  [CAP_0402]
C134  100nF  [CAP_0402]
C135  100nF  [CAP_0402]
C136  100nF  [CAP_0402]
C137  100nF  [CAP_0402]
C138  100nF  [CAP_0402]
C139  100nF  [CAP_0402]
FB4  BLM15PD121SN1D  [RES_0402]
FB5  BLM15PD121SN1D  [RES_0402]
FB6  BLM15PD121SN1D  [RES_0402]
FB7  BLM15PD121SN1D  [RES_0402]
R16  240R  [RES_0201]
R17  240R  [RES_0201]
U8  RK3399  [FBGA828_23_826X826]  (parts D,E of 24)

### Nets
GND: C120.1 C121.1 C122.1 C123.1 C124.1 C125.1 C126.1 C127.1 C128.1 C129.1 C130.1 C131.1 C132.1 C133.1 C134.1 C135.1 C136.1 C137.1 C138.1 C139.1 R16.1 R17.1
VCC_0V9: FB4.2 FB6.2
VCC_DDR: C120.2 C121.2 C122.2 C123.2 C124.2 C125.2 C126.2 C127.2 C128.2 C129.2 C130.2 C131.2 C132.2 C133.2 C134.2 C135.2 C136.2 C137.2 C138.2 C139.2 FB5.2 FB7.2 U8.J11(DDR1_VDD_1) U8.J12(DDR1_VDD_2) U8.J13(DDR1_VDD_3) U8.J14(DDR1_VDD_4) U8.J15(DDR1_VDD_5) U8.J16(DDR1_VDD_6) U8.J17(DDR1_VDD_7) U8.J18(DDR1_VDD_8) U8.K11(DDR1_VDD_9) U8.K13(DDR1_VDD_10) U8.K15(DDR1_VDD_11) U8.K17(DDR1_VDD_12) U8.L9(DDR0_VDD_1) U8.L10(DDR0_VDD_2) U8.M9(DDR0_VDD_3) U8.N9(DDR0_VDD_4) U8.N10(DDR0_VDD_5) U8.P9(DDR0_VDD_6) U8.R9(DDR0_VDD_7) U8.R10(DDR0_VDD_8) U8.T9(DDR0_VDD_9) U8.U9(DDR0_VDD_10) U8.U10(DDR0_VDD_11) U8.V9(DDR0_VDD_12)
DDR0_A0: U8.F2(DDR0_A0) ; off-sheet DDR0_A0
DDR0_A1: U8.F1(DDR0_A1) ; off-sheet DDR0_A1
DDR0_A2: U8.G1(DDR0_A2) ; off-sheet DDR0_A2
DDR0_A3: U8.G2(DDR0_A3) ; off-sheet DDR0_A3
DDR0_A4: U8.H2(DDR0_A4) ; off-sheet DDR0_A4
DDR0_A5: U8.H1(DDR0_A5) ; off-sheet DDR0_A5
DDR0_CKE0: U8.E1(DDR0_CKE0) ; off-sheet DDR0_CKE0
DDR0_CKE1: U8.F5(DDR0_CKE1) ; off-sheet DDR0_CKE1
DDR0_CLK1_N: U8.J5(DDR0_CLK1N) ; off-sheet DDR0_CLK1_N
DDR0_CLK1_P: U8.H5(DDR0_CLK1P) ; off-sheet DDR0_CLK1_P
DDR0_CLK_N: U8.J4(DDR0_CLK0N) ; off-sheet DDR0_CLK_N
DDR0_CLK_P: U8.H4(DDR0_CLK0P) ; off-sheet DDR0_CLK_P
DDR0_CS0N: U8.M6(DDR0_CSn0) ; off-sheet DDR0_CS0N
DDR0_CS1N: U8.B1(DDR0_CSn1) ; off-sheet DDR0_CS1N
DDR0_CS2N: U8.M5(DDR0_CSn2) ; off-sheet DDR0_CS2N
DDR0_CS3N: U8.C2(DDR0_CSn3) ; off-sheet DDR0_CS3N
DDR0_D0: U8.AB2(DDR0_DQ0) ; off-sheet DDR0_D0
DDR0_D1: U8.AB1(DDR0_DQ1) ; off-sheet DDR0_D1
DDR0_D2: U8.AA2(DDR0_DQ2) ; off-sheet DDR0_D2
DDR0_D3: U8.AA1(DDR0_DQ3) ; off-sheet DDR0_D3
DDR0_D4: U8.Y2(DDR0_DQ4) ; off-sheet DDR0_D4
DDR0_D5: U8.Y1(DDR0_DQ5) ; off-sheet DDR0_D5
DDR0_D6: U8.W1(DDR0_DQ6) ; off-sheet DDR0_D6
DDR0_D7: U8.W2(DDR0_DQ7) ; off-sheet DDR0_D7
DDR0_D8: U8.AF2(DDR0_DQ8) ; off-sheet DDR0_D8
DDR0_D9: U8.AE2(DDR0_DQ9) ; off-sheet DDR0_D9
DDR0_D10: U8.AF1(DDR0_DQ10) ; off-sheet DDR0_D10
DDR0_D11: U8.AD2(DDR0_DQ11) ; off-sheet DDR0_D11
DDR0_D12: U8.AE1(DDR0_DQ12) ; off-sheet DDR0_D12
DDR0_D13: U8.AD1(DDR0_DQ13) ; off-sheet DDR0_D13
DDR0_D14: U8.AC1(DDR0_DQ14) ; off-sheet DDR0_D14
DDR0_D15: U8.AC2(DDR0_DQ15) ; off-sheet DDR0_D15
DDR0_D16: U8.V1(DDR0_DQ16) ; off-sheet DDR0_D16
DDR0_D17: U8.V2(DDR0_DQ17) ; off-sheet DDR0_D17
DDR0_D18: U8.U1(DDR0_DQ18) ; off-sheet DDR0_D18
DDR0_D19: U8.U2(DDR0_DQ19) ; off-sheet DDR0_D19
DDR0_D20: U8.T1(DDR0_DQ20) ; off-sheet DDR0_D20
DDR0_D21: U8.T2(DDR0_DQ21) ; off-sheet DDR0_D21
DDR0_D22: U8.R2(DDR0_DQ22) ; off-sheet DDR0_D22
DDR0_D23: U8.R1(DDR0_DQ23) ; off-sheet DDR0_D23
DDR0_D24: U8.P1(DDR0_DQ24) ; off-sheet DDR0_D24
DDR0_D25: U8.P2(DDR0_DQ25) ; off-sheet DDR0_D25
DDR0_D26: U8.N1(DDR0_DQ26) ; off-sheet DDR0_D26
DDR0_D27: U8.M1(DDR0_DQ27) ; off-sheet DDR0_D27
DDR0_D28: U8.N2(DDR0_DQ28) ; off-sheet DDR0_D28
DDR0_D29: U8.L1(DDR0_DQ29) ; off-sheet DDR0_D29
DDR0_D30: U8.M2(DDR0_DQ30) ; off-sheet DDR0_D30
DDR0_D31: U8.L2(DDR0_DQ31) ; off-sheet DDR0_D31
DDR0_DM0: U8.Y5(DDR0_DM0) ; off-sheet DDR0_DM0
DDR0_DM1: U8.AC5(DDR0_DM1) ; off-sheet DDR0_DM1
DDR0_DM2: U8.U5(DDR0_DM2) ; off-sheet DDR0_DM2
DDR0_DM3: U8.P5(DDR0_DM3) ; off-sheet DDR0_DM3
DDR0_DQS0_N: U8.AA4(DDR0_DQS0N) ; off-sheet DDR0_DQS0_N
DDR0_DQS0_P: U8.Y4(DDR0_DQS0P) ; off-sheet DDR0_DQS0_P
DDR0_DQS1_N: U8.AD4(DDR0_DQS1N) ; off-sheet DDR0_DQS1_N
DDR0_DQS1_P: U8.AC4(DDR0_DQS1P) ; off-sheet DDR0_DQS1_P
DDR0_DQS2_N: U8.V4(DDR0_DQS2N) ; off-sheet DDR0_DQS2_N
DDR0_DQS2_P: U8.U4(DDR0_DQS2P) ; off-sheet DDR0_DQS2_P
DDR0_DQS3_N: U8.R4(DDR0_DQS3N) ; off-sheet DDR0_DQS3_N
DDR0_DQS3_P: U8.P4(DDR0_DQS3P) ; off-sheet DDR0_DQS3_P
DDR0_RST: U8.L7(DDR0_RESET) ; off-sheet DDR0_RST
DDR1_A0: U8.B10(DDR1_A0) ; off-sheet DDR1_A0
DDR1_A1: U8.A10(DDR1_A1) ; off-sheet DDR1_A1
DDR1_A2: U8.B9(DDR1_A2) ; off-sheet DDR1_A2
DDR1_A3: U8.A9(DDR1_A3) ; off-sheet DDR1_A3
DDR1_A4: U8.B8(DDR1_A4) ; off-sheet DDR1_A4
DDR1_A5: U8.A8(DDR1_A5) ; off-sheet DDR1_A5
DDR1_CKE0: U8.A5(DDR1_CKE0) ; off-sheet DDR1_CKE0
DDR1_CKE1: U8.E6(DDR1_CKE1) ; off-sheet DDR1_CKE1
DDR1_CLK1_N: U8.E8(DDR1_CLK1N) ; off-sheet DDR1_CLK1_N
DDR1_CLK1_P: U8.E9(DDR1_CLK1P) ; off-sheet DDR1_CLK1_P
DDR1_CLK_N: U8.D8(DDR1_CLK0N) ; off-sheet DDR1_CLK_N
DDR1_CLK_P: U8.D9(DDR1_CLK0P) ; off-sheet DDR1_CLK_P
DDR1_CS0N: U8.F12(DDR1_CSn0) ; off-sheet DDR1_CS0N
DDR1_CS1N: U8.A2(DDR1_CSn1) ; off-sheet DDR1_CS1N
DDR1_CS2N: U8.F11(DDR1_CSn2) ; off-sheet DDR1_CS2N
DDR1_CS3N: U8.B3(DDR1_CSn3) ; off-sheet DDR1_CS3N
DDR1_D0: U8.B15(DDR1_DQ0) ; off-sheet DDR1_D0
DDR1_D1: U8.A15(DDR1_DQ1) ; off-sheet DDR1_D1
DDR1_D2: U8.B16(DDR1_DQ2) ; off-sheet DDR1_D2
DDR1_D3: U8.A16(DDR1_DQ3) ; off-sheet DDR1_D3
DDR1_D4: U8.B17(DDR1_DQ4) ; off-sheet DDR1_D4
DDR1_D5: U8.A17(DDR1_DQ5) ; off-sheet DDR1_D5
DDR1_D6: U8.A18(DDR1_DQ6) ; off-sheet DDR1_D6
DDR1_D7: U8.B18(DDR1_DQ7) ; off-sheet DDR1_D7
DDR1_D8: U8.B11(DDR1_DQ8) ; off-sheet DDR1_D8
DDR1_D9: U8.B12(DDR1_DQ9) ; off-sheet DDR1_D9
DDR1_D10: U8.A11(DDR1_DQ10) ; off-sheet DDR1_D10
DDR1_D11: U8.B13(DDR1_DQ11) ; off-sheet DDR1_D11
DDR1_D12: U8.A12(DDR1_DQ12) ; off-sheet DDR1_D12
DDR1_D13: U8.A13(DDR1_DQ13) ; off-sheet DDR1_D13
DDR1_D14: U8.A14(DDR1_DQ14) ; off-sheet DDR1_D14
DDR1_D15: U8.B14(DDR1_DQ15) ; off-sheet DDR1_D15
DDR1_D16: U8.A19(DDR1_DQ16) ; off-sheet DDR1_D16
DDR1_D17: U8.B19(DDR1_DQ17) ; off-sheet DDR1_D17
DDR1_D18: U8.A20(DDR1_DQ18) ; off-sheet DDR1_D18
DDR1_D19: U8.B20(DDR1_DQ19) ; off-sheet DDR1_D19
DDR1_D20: U8.A21(DDR1_DQ20) ; off-sheet DDR1_D20
DDR1_D21: U8.B21(DDR1_DQ21) ; off-sheet DDR1_D21
DDR1_D22: U8.B22(DDR1_DQ22) ; off-sheet DDR1_D22
DDR1_D23: U8.A22(DDR1_DQ23) ; off-sheet DDR1_D23
DDR1_D24: U8.A23(DDR1_DQ24) ; off-sheet DDR1_D24
DDR1_D25: U8.B23(DDR1_DQ25) ; off-sheet DDR1_D25
DDR1_D26: U8.A24(DDR1_DQ26) ; off-sheet DDR1_D26
DDR1_D27: U8.A25(DDR1_DQ27) ; off-sheet DDR1_D27
DDR1_D28: U8.B24(DDR1_DQ28) ; off-sheet DDR1_D28
DDR1_D29: U8.A26(DDR1_DQ29) ; off-sheet DDR1_D29
DDR1_D30: U8.B25(DDR1_DQ30) ; off-sheet DDR1_D30
DDR1_D31: U8.B26(DDR1_DQ31) ; off-sheet DDR1_D31
DDR1_DM0: U8.E17(DDR1_DM0) ; off-sheet DDR1_DM0
DDR1_DM1: U8.E14(DDR1_DM1) ; off-sheet DDR1_DM1
DDR1_DM2: U8.E20(DDR1_DM2) ; off-sheet DDR1_DM2
DDR1_DM3: U8.E23(DDR1_DM3) ; off-sheet DDR1_DM3
DDR1_DQS0_N: U8.D17(DDR1_DQS0N) ; off-sheet DDR1_DQS0_N
DDR1_DQS0_P: U8.D18(DDR1_DQS0P) ; off-sheet DDR1_DQS0_P
DDR1_DQS1_N: U8.D14(DDR1_DQS1N) ; off-sheet DDR1_DQS1_N
DDR1_DQS1_P: U8.D15(DDR1_DQS1P) ; off-sheet DDR1_DQS1_P
DDR1_DQS2_N: U8.D20(DDR1_DQS2N) ; off-sheet DDR1_DQS2_N
DDR1_DQS2_P: U8.D21(DDR1_DQS2P) ; off-sheet DDR1_DQS2_P
DDR1_DQS3_N: U8.D23(DDR1_DQS3N) ; off-sheet DDR1_DQS3_N
DDR1_DQS3_P: U8.D24(DDR1_DQS3P) ; off-sheet DDR1_DQS3_P
DDR1_RST: U8.G11(DDR1_RESET) ; off-sheet DDR1_RST
NetFB4_1: FB4.1 U8.H14(DDR1PLL_AVDD_0V9)
NetFB5_1: FB5.1 U8.G12(DDR1_CLK_VDD)
NetFB6_1: FB6.1 U8.R8(DDR0PLL_AVDD_0V9)
NetFB7_1: FB7.1 U8.M7(DDR0_CLK_VDD)
NetR16_2: R16.2 U8.G15(DDR1_PZQ)
NetR17_2: R17.2 U8.R7(DDR0_PZQ)

Not connected (* = marked no-connect by the designer): U8 A3(DDR1_A12)* A4(DDR1_A10)* A6(DDR1_A9)* A7(DDR1_A7)* B2(DDR1_BA0)* B4(DDR1_A13)* B6(DDR1_A8)* B7(DDR1_A6)* C1(DDR0_A12)* C3(DDR0_BA0)* C4(DDR1_A14)* C5(DDR1_A11)* C6(DDR1_RASn)* D1(DDR0_A10)* D2(DDR0_A13)* D3(DDR0_A14)* D6(DDR1_BA1)* D11(DDR1_ODT0)* D12(DDR1_BA2)* E3(DDR0_A11)* E11(DDR1_ODT1)* F3(DDR0_RASn)* F4(DDR0_BA1)* F7(DDR1_WEn)* F9(DDR1_CASn)* F14(DDR1_PLL_TESTOUT_P)* F17(DDR1_ATB0)* G6(DDR0_WEn)* G8(DDR1_A15)* G14(DDR1_PLL_TESTOUT_N)* G17(DDR1_ATB1)* H6(DDR0_CASn)* H7(DDR0_A15)* J1(DDR0_A6)* J2(DDR0_A7)* K1(DDR0_A9)* K2(DDR0_A8)* L4(DDR0_ODT0)* L5(DDR0_ODT1)* M4(DDR0_BA2)* U6(DDR0_ATB0)* U7(DDR0_ATB1)* V6(DDR0_PLL_TESTOUT_P)* V7(DDR0_PLL_TESTOUT_N)*

### Layout directives
differential pair; differential pair class DIFF100_DDR_CLK: DDR1_CLK1_N, DDR1_CLK1_P, DDR1_CLK_N, DDR1_CLK_P, DDR1_DQS0_N, DDR1_DQS0_P, DDR1_DQS1_N, DDR1_DQS1_P, DDR1_DQS2_N, DDR1_DQS2_P, DDR1_DQS3_N, DDR1_DQS3_P
differential pair; differential pair class DIFF100_DDR_DQS: DDR0_CLK1_N, DDR0_CLK1_P, DDR0_CLK_N, DDR0_CLK_P, DDR0_DQS0_N, DDR0_DQS0_P, DDR0_DQS1_N, DDR0_DQS1_P, DDR0_DQS2_N, DDR0_DQS2_P, DDR0_DQS3_N, DDR0_DQS3_P
net class DDR_G-1: DDR0_D0, DDR0_D1, DDR0_D2, DDR0_D3, DDR0_D4, DDR0_D5, DDR0_D6, DDR0_D7, DDR0_DQS0_N, DDR0_DQS0_P, DDR1_D0, DDR1_D1, DDR1_D2, DDR1_D3, DDR1_D4, DDR1_D5, DDR1_D6, DDR1_D7, DDR1_DM0, DDR1_DM1, DDR1_DM2, DDR1_DM3, DDR1_DQS0_N, DDR1_DQS0_P
net class DDR_G-2: DDR0_D8, DDR0_D9, DDR0_D10, DDR0_D11, DDR0_D12, DDR0_D13, DDR0_D14, DDR0_D15, DDR0_DQS1_N, DDR0_DQS1_P, DDR1_D8, DDR1_D9, DDR1_D10, DDR1_D11, DDR1_D12, DDR1_D13, DDR1_D14, DDR1_D15, DDR1_DQS1_N, DDR1_DQS1_P
net class DDR_G-3: DDR0_D16, DDR0_D17, DDR0_D18, DDR0_D19, DDR0_D20, DDR0_D21, DDR0_D22, DDR0_D23, DDR0_DQS2_N, DDR0_DQS2_P, DDR1_D16, DDR1_D17, DDR1_D18, DDR1_D19, DDR1_D20, DDR1_D21, DDR1_D22, DDR1_D23, DDR1_DQS2_N, DDR1_DQS2_P
net class DDR_G-4: DDR0_D24, DDR0_D25, DDR0_D26, DDR0_D27, DDR0_D28, DDR0_D29, DDR0_D30, DDR0_D31, DDR0_DQS3_N, DDR0_DQS3_P, DDR1_D24, DDR1_D25, DDR1_D26, DDR1_D27, DDR1_D28, DDR1_D29, DDR1_D30, DDR1_D31, DDR1_DQS3_N, DDR1_DQS3_P
net class 50OHM_DDR_A: DDR0_A0, DDR0_A1, DDR0_A2, DDR0_A3, DDR0_A4, DDR0_A5, DDR1_A0, DDR1_A1, DDR1_A2, DDR1_A3, DDR1_A4, DDR1_A5
net class DIFF_PAIR_CLASS: DDR0_CLK1_N, DDR0_CLK1_P, DDR0_CLK_N, DDR0_CLK_P, DDR0_DQS0_N, DDR0_DQS0_P, DDR0_DQS1_N, DDR0_DQS1_P, DDR0_DQS2_N, DDR0_DQS2_P, DDR0_DQS3_N, DDR0_DQS3_P, DDR1_CLK1_N, DDR1_CLK1_P, DDR1_CLK_N, DDR1_CLK_P, DDR1_DQS0_N, DDR1_DQS0_P, DDR1_DQS1_N, DDR1_DQS1_P, DDR1_DQS2_N, DDR1_DQS2_P, DDR1_DQS3_N, DDR1_DQS3_P
net class 50OHM_DDR_Ctrl: DDR0_CKE0, DDR0_CKE1, DDR0_CS0N, DDR0_CS1N, DDR0_CS2N, DDR0_CS3N, DDR1_CKE0, DDR1_CKE1, DDR1_CS0N, DDR1_CS1N, DDR1_CS2N, DDR1_CS3N
net class 50OHM_DDR_D: DDR0_D0, DDR0_D1, DDR0_D2, DDR0_D3, DDR0_D4, DDR0_D5, DDR0_D6, DDR0_D7, DDR0_D8, DDR0_D9, DDR0_D10, DDR0_D11, DDR0_D12, DDR0_D13, DDR0_D14, DDR0_D15, DDR0_D16, DDR0_D17, DDR0_D18, DDR0_D19, DDR0_D20, DDR0_D21, DDR0_D22, DDR0_D23, DDR0_D24, DDR0_D25, DDR0_D26, DDR0_D27, DDR0_D28, DDR0_D29, DDR0_D30, DDR0_D31, DDR0_DM0, DDR0_DM1, DDR0_DM2, DDR0_DM3, DDR1_D0, DDR1_D1, DDR1_D2, DDR1_D3, DDR1_D4, DDR1_D5, DDR1_D6, DDR1_D7, DDR1_D8, DDR1_D9, DDR1_D10, DDR1_D11, DDR1_D12, DDR1_D13, DDR1_D14, DDR1_D15, DDR1_D16, DDR1_D17, DDR1_D18, DDR1_D19, DDR1_D20, DDR1_D21, DDR1_D22, DDR1_D23, DDR1_D24, DDR1_D25, DDR1_D26, DDR1_D27, DDR1_D28, DDR1_D29, DDR1_D30, DDR1_D31, DDR1_DM0, DDR1_DM1, DDR1_DM2, DDR1_DM3

### Notes on the sheet
- Nazwa arkusza
- Nazwa projektu
- Imie i nazwisko
- Data wykonania
- Numer indeksu

### Library data of the parts
C120 C130 = CAP_22uF-10V-20%-0603: as C1 on sheet LPDDR4 SDRAM - 1; Case/Package: 0603; Supplier-1: Digikey
C121 C131 = CAP_10uF-10V-10%-0603: as C2 on sheet LPDDR4 SDRAM - 1; Case/Package: 0603; Supplier-1: Digikey
C122-C129 C132-C139 = CAP_100nF-10V-10%-0402: as C3 on sheet LPDDR4 SDRAM - 1; Case/Package: 0402; Supplier-1: Digikey
FB4-FB7 = FB_120R-1.3A-100Mhz-0402: 120 Ohms @ 100MHz 1 Power Line Ferrite Bead 0402 (1005 Metric) 1.3A 90mOhm; Manufacturer: Murata Electronics; Mnaufacturer Part Number: BLM15PD121SN1D; Case/Package: 0402; Supplier-1: Digikey
R16 R17 = RES_240R-0.05W-1%-0201: as R2 on sheet LPDDR4 SDRAM - 1; Case/Package: 0201; Supplier-1: Digikey
U8 = IC_RK3399-FCBGA828: RK3399 is a low power, high performance processor for computing, personal mobile.; Manufacturer: Rockchip; Manufacturer Part Number: RK3399; Case/Package: FCBGA828; Supplier-1: Rockchip

## Sheet SOC Power Pins.SchDoc: RK3399 SOM Module
size A3; Date: 23.05.2023; Author: Łukasz Nowarkiewicz; SheetNumber: 6; SheetTotal: 21; RegistrationBookNumber: 144201; title_sheet: SOC Power Pins
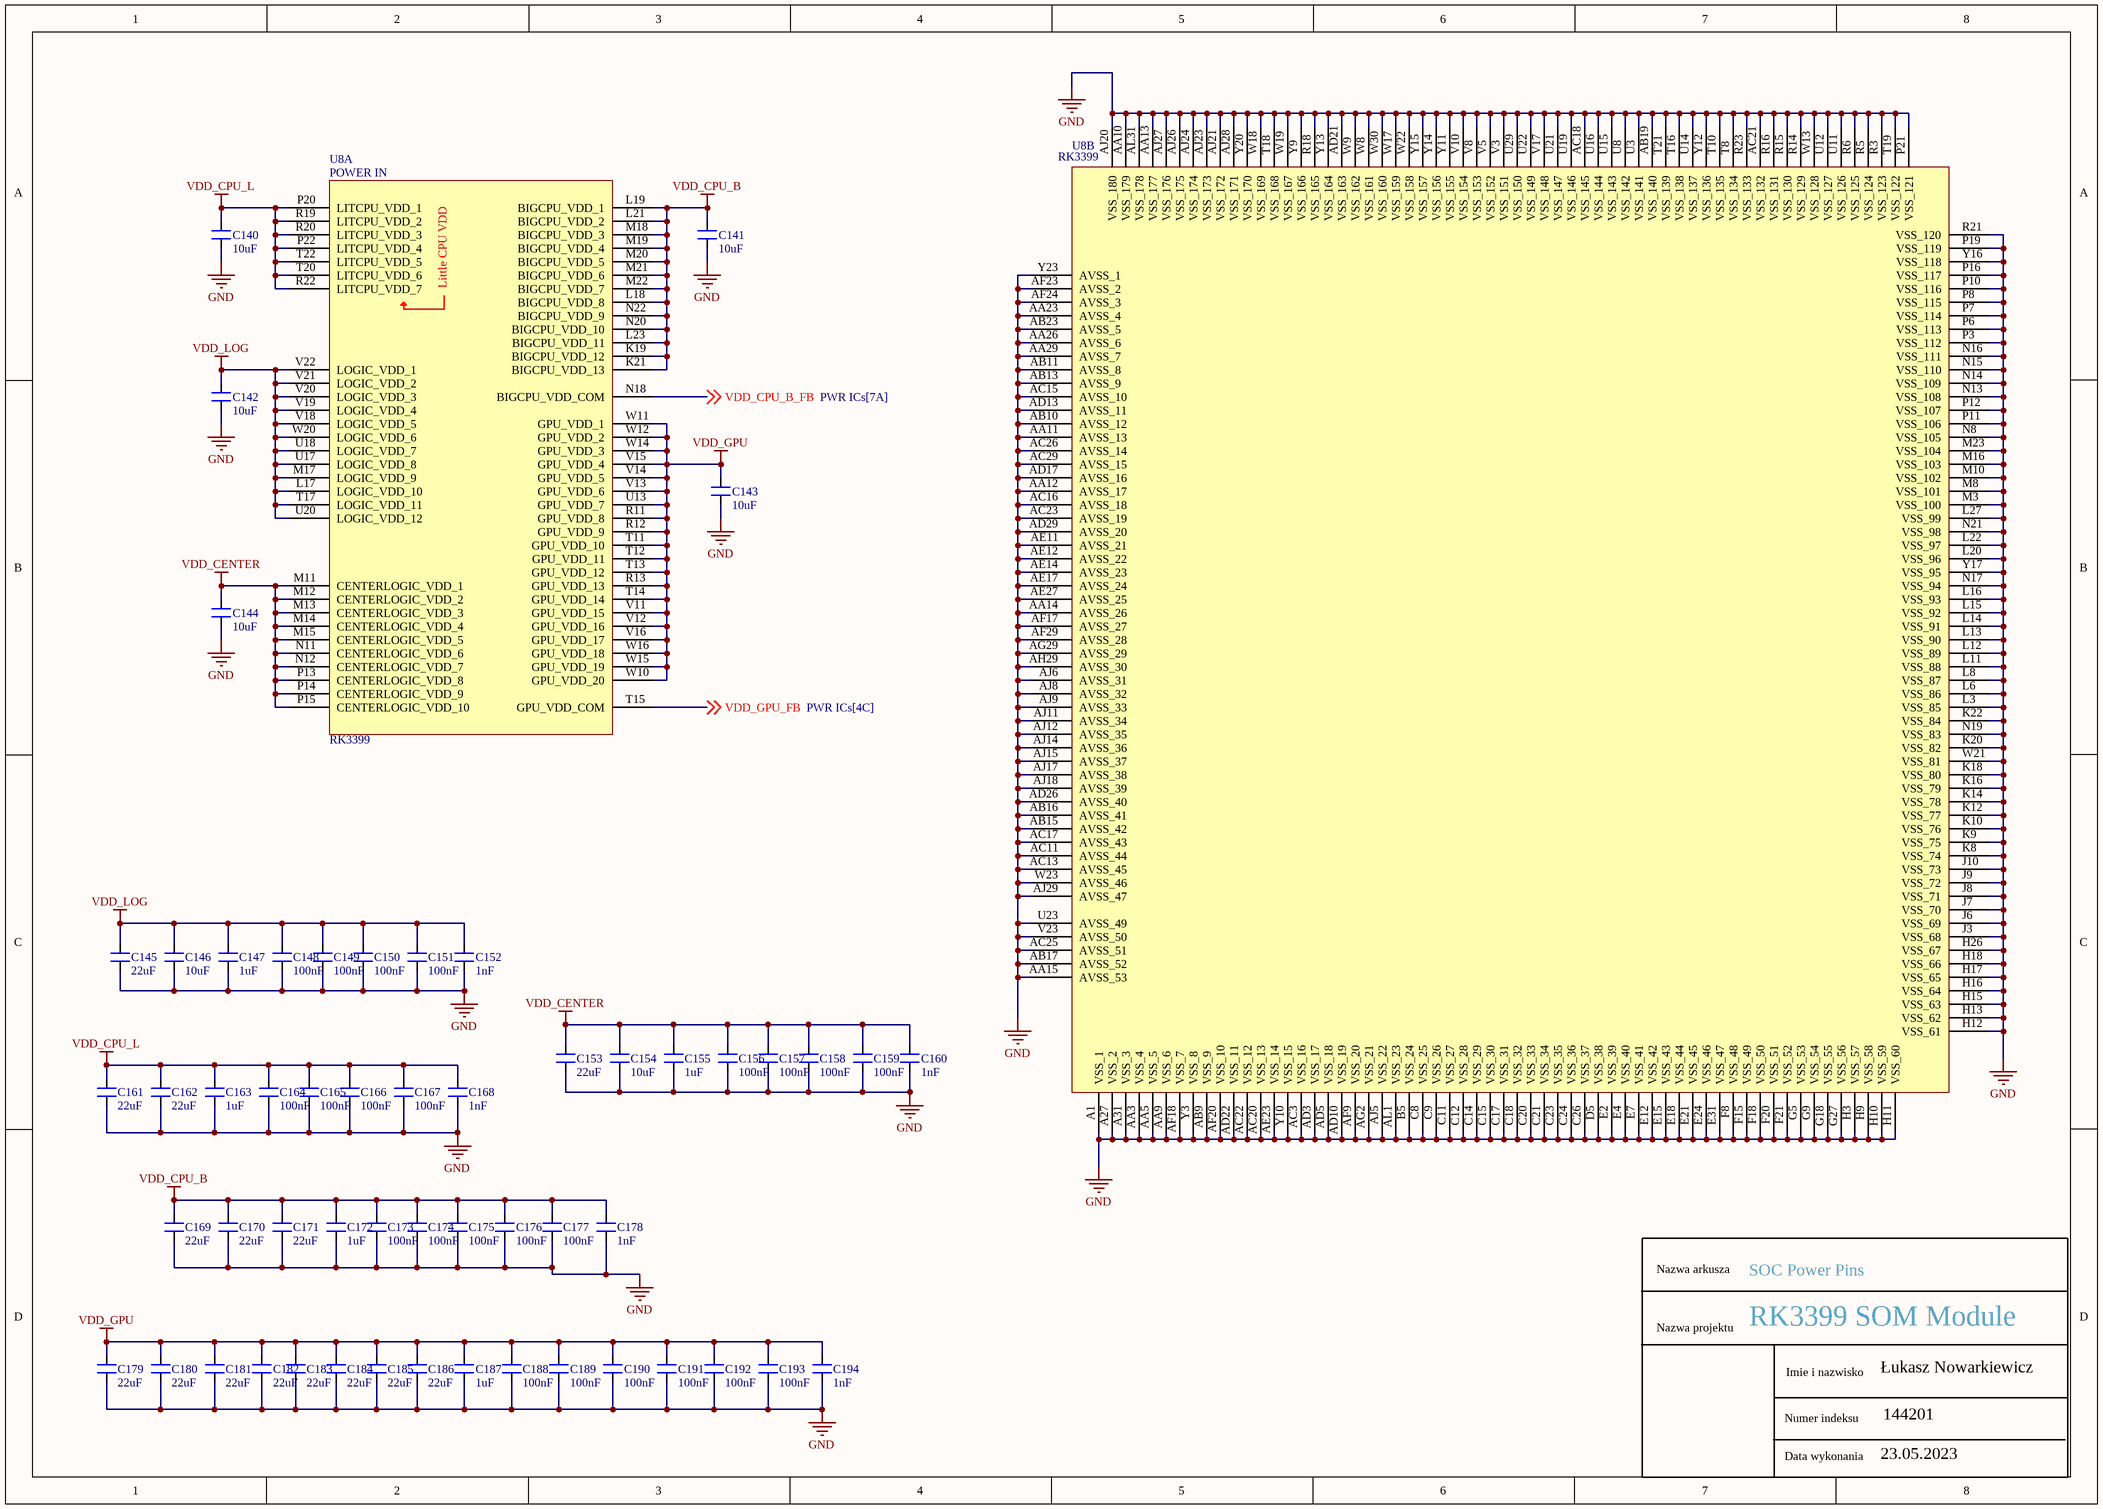
[diagram p5: SOC Power Pins.SchDoc]

### Parts
C140  10uF  [CAP_0402]
C141  10uF  [CAP_0402]
C142  10uF  [CAP_0402]
C143  10uF  [CAP_0402]
C144  10uF  [CAP_0402]
C145  22uF  [CAP_0402]
C146  10uF  [CAP_0402]
C147  1uF  [CAP_0201]
C148  100nF  [CAP_0201]
C149  100nF  [CAP_0201]
C150  100nF  [CAP_0201]
C151  100nF  [CAP_0201]
C152  1nF  [CAP_0201]
C153  22uF  [CAP_0402]
C154  10uF  [CAP_0402]
C155  1uF  [CAP_0201]
C156  100nF  [CAP_0201]
C157  100nF  [CAP_0201]
C158  100nF  [CAP_0201]
C159  100nF  [CAP_0201]
C160  1nF  [CAP_0201]
C161  22uF  [CAP_0402]
C162  22uF  [CAP_0402]
C163  1uF  [CAP_0201]
C164  100nF  [CAP_0201]
C165  100nF  [CAP_0201]
C166  100nF  [CAP_0201]
C167  100nF  [CAP_0201]
C168  1nF  [CAP_0201]
C169  22uF  [CAP_0402]
C170  22uF  [CAP_0402]
C171  22uF  [CAP_0402]
C172  1uF  [CAP_0201]
C173  100nF  [CAP_0201]
C174  100nF  [CAP_0201]
C175  100nF  [CAP_0201]
C176  100nF  [CAP_0201]
C177  100nF  [CAP_0201]
C178  1nF  [CAP_0201]
C179  22uF  [CAP_0402]
C180  22uF  [CAP_0402]
C181  22uF  [CAP_0402]
C182  22uF  [CAP_0402]
C183  22uF  [CAP_0402]
C184  22uF  [CAP_0402]
C185  22uF  [CAP_0402]
C186  22uF  [CAP_0402]
C187  1uF  [CAP_0201]
C188  100nF  [CAP_0201]
C189  100nF  [CAP_0201]
C190  100nF  [CAP_0201]
C191  100nF  [CAP_0201]
C192  100nF  [CAP_0201]
C193  100nF  [CAP_0201]
C194  1nF  [CAP_0201]
U8  RK3399  [FBGA828_23_826X826]  (parts A,B of 24)

### Nets
GND: C140.1 C141.1 C142.1 C143.1 C144.1 C145.1 C146.1 C147.1 C148.1 C149.1 C150.1 C151.1 C152.1 C153.1 C154.1 C155.1 C156.1 C157.1 C158.1 C159.1 C160.1 C161.1 C162.1 C163.1 C164.1 C165.1 C166.1 C167.1 C168.1 C169.1 C170.1 C171.1 C172.1 C173.1 C174.1 C175.1 C176.1 C177.1 C178.1 C179.1 C180.1 C181.1 C182.1 C183.1 C184.1 C185.1 C186.1 C187.1 C188.1 C189.1 C190.1 C191.1 C192.1 C193.1 C194.1 U8.A1(VSS_1) U8.A27(VSS_2) U8.A31(VSS_3) U8.AA3(VSS_4) U8.AA5(VSS_5) U8.AA9(VSS_6) U8.AA10(VSS_179) U8.AA11(AVSS_13) U8.AA12(AVSS_17) U8.AA13(VSS_177) U8.AA14(AVSS_26) U8.AA15(AVSS_53) U8.AA23(AVSS_4) U8.AA26(AVSS_6) U8.AA29(AVSS_7) U8.AB9(VSS_9) U8.AB10(AVSS_12) U8.AB11(AVSS_8) U8.AB13(AVSS_9) U8.AB15(AVSS_42) U8.AB16(AVSS_41) U8.AB17(AVSS_52) U8.AB19(VSS_140) U8.AB23(AVSS_5) U8.AC3(VSS_16) U8.AC11(AVSS_44) U8.AC13(AVSS_45) U8.AC15(AVSS_10) U8.AC16(AVSS_18) U8.AC17(AVSS_43) U8.AC18(VSS_145) U8.AC20(VSS_13) U8.AC21(VSS_132) U8.AC22(VSS_12) U8.AC23(AVSS_19) U8.AC25(AVSS_51) U8.AC26(AVSS_14) U8.AC29(AVSS_15) U8.AD3(VSS_17) U8.AD5(VSS_18) U8.AD10(VSS_19) U8.AD13(AVSS_11) U8.AD17(AVSS_16) U8.AD21(VSS_163) U8.AD22(VSS_11) U8.AD26(AVSS_40) U8.AD29(AVSS_20) U8.AE11(AVSS_21) U8.AE12(AVSS_22) U8.AE14(AVSS_23) U8.AE17(AVSS_24) U8.AE23(VSS_14) U8.AE27(AVSS_25) U8.AF9(VSS_20) U8.AF17(AVSS_27) U8.AF18(VSS_7) U8.AF20(VSS_10) U8.AF23(AVSS_2) U8.AF24(AVSS_3) U8.AF29(AVSS_28) U8.AG2(VSS_21) U8.AG29(AVSS_29) U8.AH29(AVSS_30) U8.AJ5(VSS_22) U8.AJ6(AVSS_31) U8.AJ8(AVSS_32) U8.AJ9(AVSS_33) U8.AJ11(AVSS_34) U8.AJ12(AVSS_35) U8.AJ14(AVSS_36) U8.AJ15(AVSS_37) U8.AJ17(AVSS_38) U8.AJ18(AVSS_39) U8.AJ20(VSS_180) U8.AJ21(VSS_172) U8.AJ23(VSS_173) U8.AJ24(VSS_174) U8.AJ26(VSS_175) U8.AJ27(VSS_176) U8.AJ28(VSS_171) U8.AJ29(AVSS_47) U8.AL1(VSS_23) U8.AL31(VSS_178) U8.B5(VSS_24) U8.C8(VSS_25) U8.C9(VSS_26) U8.C11(VSS_27) U8.C12(VSS_28) U8.C14(VSS_29) U8.C15(VSS_30) U8.C17(VSS_31) U8.C18(VSS_32) U8.C20(VSS_33) U8.C21(VSS_34) U8.C23(VSS_35) U8.C24(VSS_36) U8.C26(VSS_37) U8.D5(VSS_38) U8.E2(VSS_39) U8.E4(VSS_40) U8.E7(VSS_41) U8.E12(VSS_42) U8.E15(VSS_43) U8.E18(VSS_44) U8.E21(VSS_45) U8.E24(VSS_46) U8.E31(VSS_47) U8.F8(VSS_48) U8.F15(VSS_49) U8.F18(VSS_50) U8.F20(VSS_51) U8.F21(VSS_52) U8.G5(VSS_53) U8.G9(VSS_54) U8.G18(VSS_55) U8.G27(VSS_56) U8.H3(VSS_57) U8.H9(VSS_58) U8.H10(VSS_59) U8.H11(VSS_60) U8.H12(VSS_61) U8.H13(VSS_62) U8.H15(VSS_63) U8.H16(VSS_64) U8.H17(VSS_65) U8.H18(VSS_66) U8.H26(VSS_67) U8.J3(VSS_68) U8.J6(VSS_69) U8.J7(VSS_70) U8.J8(VSS_71) U8.J9(VSS_72) U8.J10(VSS_73) U8.K8(VSS_74) U8.K9(VSS_75) U8.K10(VSS_76) U8.K12(VSS_77) U8.K14(VSS_78) U8.K16(VSS_79) U8.K18(VSS_80) U8.K20(VSS_82) U8.K22(VSS_84) U8.L3(VSS_85) U8.L6(VSS_86) U8.L8(VSS_87) U8.L11(VSS_88) U8.L12(VSS_89) U8.L13(VSS_90) U8.L14(VSS_91) U8.L15(VSS_92) U8.L16(VSS_93) U8.L20(VSS_96) U8.L22(VSS_97) U8.L27(VSS_99) U8.M3(VSS_100) U8.M8(VSS_101) U8.M10(VSS_102) U8.M16(VSS_103) U8.M23(VSS_104) U8.N8(VSS_105) U8.N13(VSS_108) U8.N14(VSS_109) U8.N15(VSS_110) U8.N16(VSS_111) U8.N17(VSS_94) U8.N19(VSS_83) U8.N21(VSS_98) U8.P3(VSS_112) U8.P6(VSS_113) U8.P7(VSS_114) U8.P8(VSS_115) U8.P10(VSS_116) U8.P11(VSS_106) U8.P12(VSS_107) U8.P16(VSS_117) U8.P19(VSS_119) U8.P21(VSS_121) U8.R3(VSS_123) U8.R5(VSS_124) U8.R6(VSS_125) U8.R14(VSS_129) U8.R15(VSS_130) U8.R16(VSS_131) U8.R18(VSS_165) U8.R21(VSS_120) U8.R23(VSS_133) U8.T8(VSS_134) U8.T10(VSS_135) U8.T16(VSS_138) U8.T18(VSS_168) U8.T19(VSS_122) U8.T21(VSS_139) U8.U3(VSS_141) U8.U8(VSS_142) U8.U11(VSS_126) U8.U12(VSS_127) U8.U14(VSS_137) U8.U15(VSS_143) U8.U16(VSS_144) U8.U19(VSS_146) U8.U21(VSS_147) U8.U22(VSS_149) U8.U23(AVSS_49) U8.U29(VSS_150) U8.V3(VSS_151) U8.V5(VSS_152) U8.V8(VSS_153) U8.V10(VSS_154) U8.V17(VSS_148) U8.V23(AVSS_50) U8.W8(VSS_161) U8.W9(VSS_162) U8.W13(VSS_128) U8.W17(VSS_159) U8.W18(VSS_169) U8.W19(VSS_167) U8.W21(VSS_81) U8.W22(VSS_158) U8.W23(AVSS_46) U8.W30(VSS_160) U8.Y3(VSS_8) U8.Y9(VSS_166) U8.Y10(VSS_15) U8.Y11(VSS_155) U8.Y12(VSS_136) U8.Y13(VSS_164) U8.Y14(VSS_156) U8.Y15(VSS_157) U8.Y16(VSS_118) U8.Y17(VSS_95) U8.Y20(VSS_170) U8.Y23(AVSS_1)
VDD_CENTER: C144.2 C153.2 C154.2 C155.2 C156.2 C157.2 C158.2 C159.2 C160.2 U8.M11(CENTERLOGIC_VDD_1) U8.M12(CENTERLOGIC_VDD_2) U8.M13(CENTERLOGIC_VDD_3) U8.M14(CENTERLOGIC_VDD_4) U8.M15(CENTERLOGIC_VDD_5) U8.N11(CENTERLOGIC_VDD_6) U8.N12(CENTERLOGIC_VDD_7) U8.P13(CENTERLOGIC_VDD_8) U8.P14(CENTERLOGIC_VDD_9) U8.P15(CENTERLOGIC_VDD_10)
VDD_CPU_B: C141.2 C169.2 C170.2 C171.2 C172.2 C173.2 C174.2 C175.2 C176.2 C177.2 C178.2 U8.K19(BIGCPU_VDD_12) U8.K21(BIGCPU_VDD_13) U8.L18(BIGCPU_VDD_8) U8.L19(BIGCPU_VDD_1) U8.L21(BIGCPU_VDD_2) U8.L23(BIGCPU_VDD_11) U8.M18(BIGCPU_VDD_3) U8.M19(BIGCPU_VDD_4) U8.M20(BIGCPU_VDD_5) U8.M21(BIGCPU_VDD_6) U8.M22(BIGCPU_VDD_7) U8.N20(BIGCPU_VDD_10) U8.N22(BIGCPU_VDD_9)
VDD_CPU_L: C140.2 C161.2 C162.2 C163.2 C164.2 C165.2 C166.2 C167.2 C168.2 U8.P20(LITCPU_VDD_1) U8.P22(LITCPU_VDD_4) U8.R19(LITCPU_VDD_2) U8.R20(LITCPU_VDD_3) U8.R22(LITCPU_VDD_7) U8.T20(LITCPU_VDD_6) U8.T22(LITCPU_VDD_5)
VDD_GPU: C143.2 C179.2 C180.2 C181.2 C182.2 C183.2 C184.2 C185.2 C186.2 C187.2 C188.2 C189.2 C190.2 C191.2 C192.2 C193.2 C194.2 U8.R11(GPU_VDD_8) U8.R12(GPU_VDD_9) U8.R13(GPU_VDD_13) U8.T11(GPU_VDD_10) U8.T12(GPU_VDD_11) U8.T13(GPU_VDD_12) U8.T14(GPU_VDD_14) U8.U13(GPU_VDD_7) U8.V11(GPU_VDD_15) U8.V12(GPU_VDD_16) U8.V13(GPU_VDD_6) U8.V14(GPU_VDD_5) U8.V15(GPU_VDD_4) U8.V16(GPU_VDD_17) U8.W10(GPU_VDD_20) U8.W11(GPU_VDD_1) U8.W12(GPU_VDD_2) U8.W14(GPU_VDD_3) U8.W15(GPU_VDD_19) U8.W16(GPU_VDD_18)
VDD_LOG: C142.2 C145.2 C146.2 C147.2 C148.2 C149.2 C150.2 C151.2 C152.2 U8.L17(LOGIC_VDD_10) U8.M17(LOGIC_VDD_9) U8.T17(LOGIC_VDD_11) U8.U17(LOGIC_VDD_8) U8.U18(LOGIC_VDD_7) U8.U20(LOGIC_VDD_12) U8.V18(LOGIC_VDD_5) U8.V19(LOGIC_VDD_4) U8.V20(LOGIC_VDD_3) U8.V21(LOGIC_VDD_2) U8.V22(LOGIC_VDD_1) U8.W20(LOGIC_VDD_6)
VDD_CPU_B_FB: U8.N18(BIGCPU_VDD_COM) ; off-sheet VDD_CPU_B_FB
VDD_GPU_FB: U8.T15(GPU_VDD_COM) ; off-sheet VDD_GPU_FB

### Notes on the sheet
- Nazwa arkusza
- Nazwa projektu
- Imie i nazwisko
- Data wykonania
- Numer indeksu
- (in symbol IC_RK3399-FCBGA828, part A) POWER IN; Little CPU VDD

### Library data of the parts
C140-C144 C146 C154 = CAP_10uF-10V-20%-0402: 10µF ±20% 10V Ceramic Capacitor X5R 0402 (1005 Metric); Manufacturer Part Number: CL05A106MP5NUNC; Manufacturer: Samsung Electro-Mechanics; Case/Package: 0402; Supplier-1: Digikey
C145 C153 C161 C162 C169-C171 C179-C186 = CAP_22uF-6.3V-20%-0402: 22µF ±20% 6.3V Ceramic Capacitor X5R 0402 (1005 Metric); Manufacturer: Murata Electronics; Manufacturer Part Number: CL05A226MQ5N6J8; Case/Package: 0402; Supplier-1: Digikey
C147 C155 C163 C172 C187 = CAP_1uF-16V-10%-0201: 1µF ±20% 16V Ceramic Capacitor X5R 0201 (0603 Metric); Manufacturer: Samsung Electro-Mechanics; Manufacturer Part Number: CL03A105MO3NRNH; Case/Package: 0201; Supplier-1: Digikey
C148-C151 C156-C159 C164-C167 C173-C177 C188-C193 = CAP_100nF-25V-10%-0201: 0.1µF ±10% 25V Ceramic Capacitor X5R 0201 (0603 Metric); Manufacturer: TDK Corporation; Manufacturer Part Number: C0603X5R1E104K030BB; Case/Package: 0201; Supplier-1: Digikey
C152 C160 C168 C178 C194 = CAP_1nF-16V-10%-0201: 1000pF ±10% 16V Ceramic Capacitor X7R 0201 (0603 Metric); Manufacturer: Murata Electronics; Manufacturer Part Number: GRM033R71C102KA01D; Case/Package: 0201; Supplier-1: Digikey
U8 = IC_RK3399-FCBGA828: as U8 on sheet SOC SDRAM; Manufacturer Part Number: RK3399; Case/Package: FCBGA828; Supplier-1: Rockchip